# EAGLE board RADAR_Main_Board (EAGLE 7.4.0), part 1 of 7
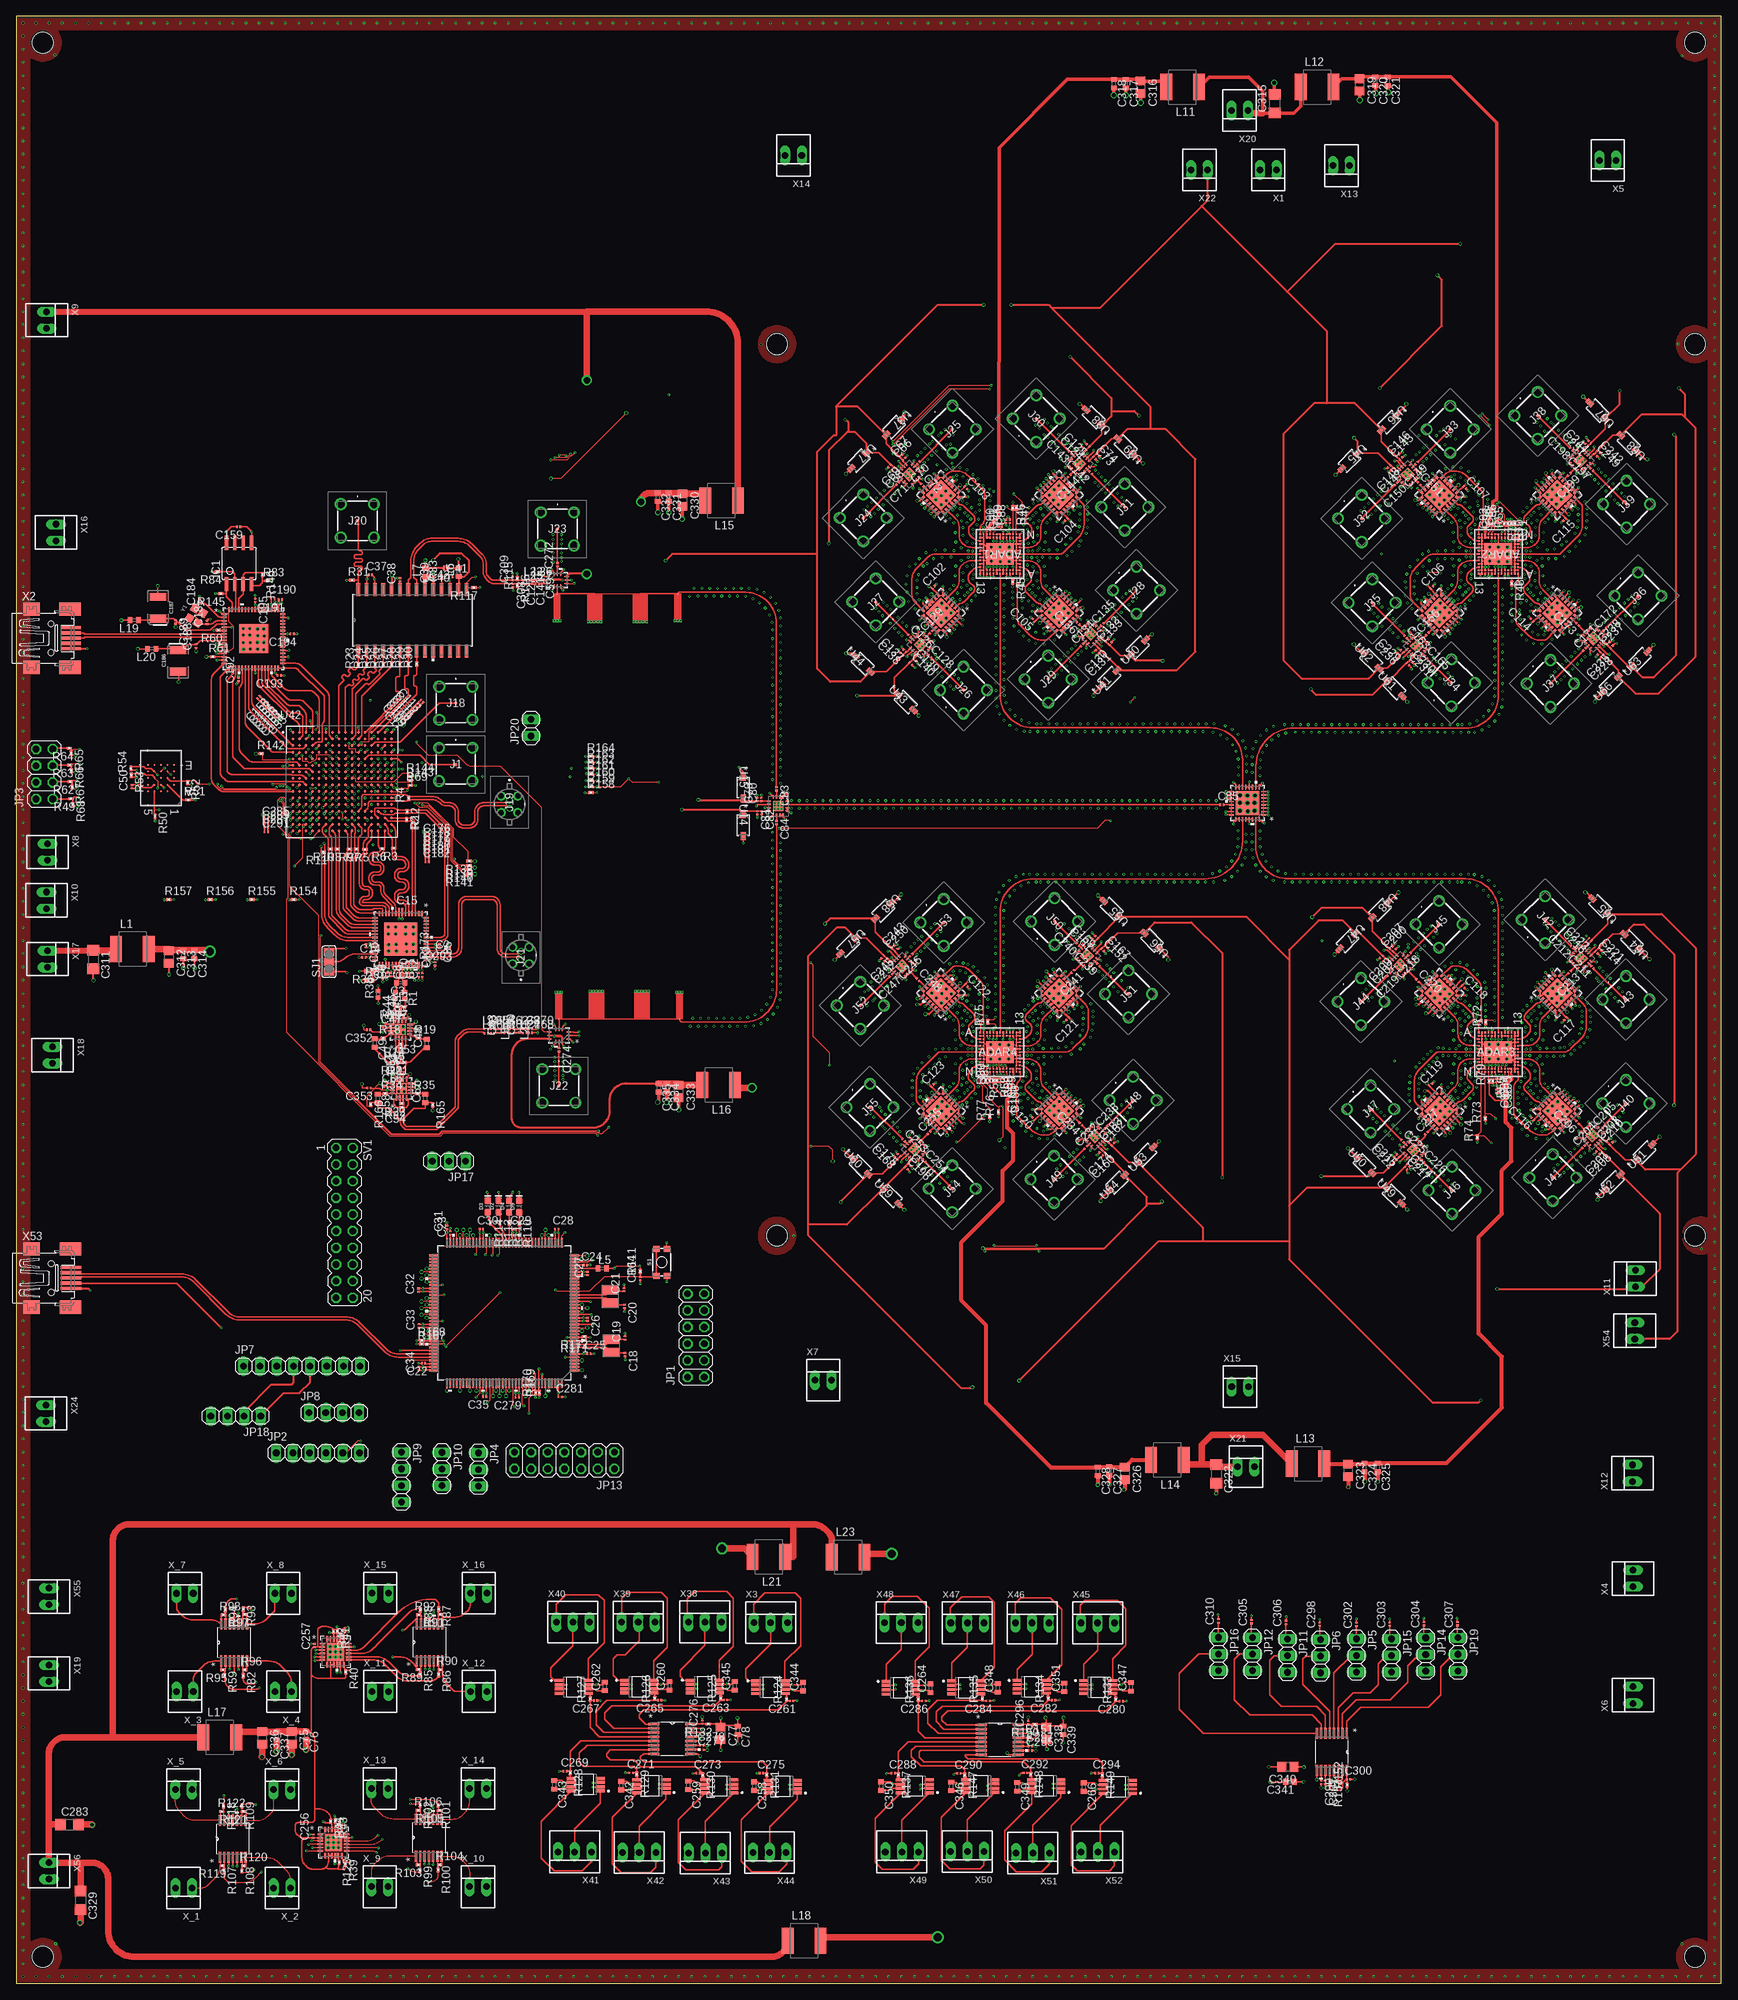
[diagram p20: board, top side]
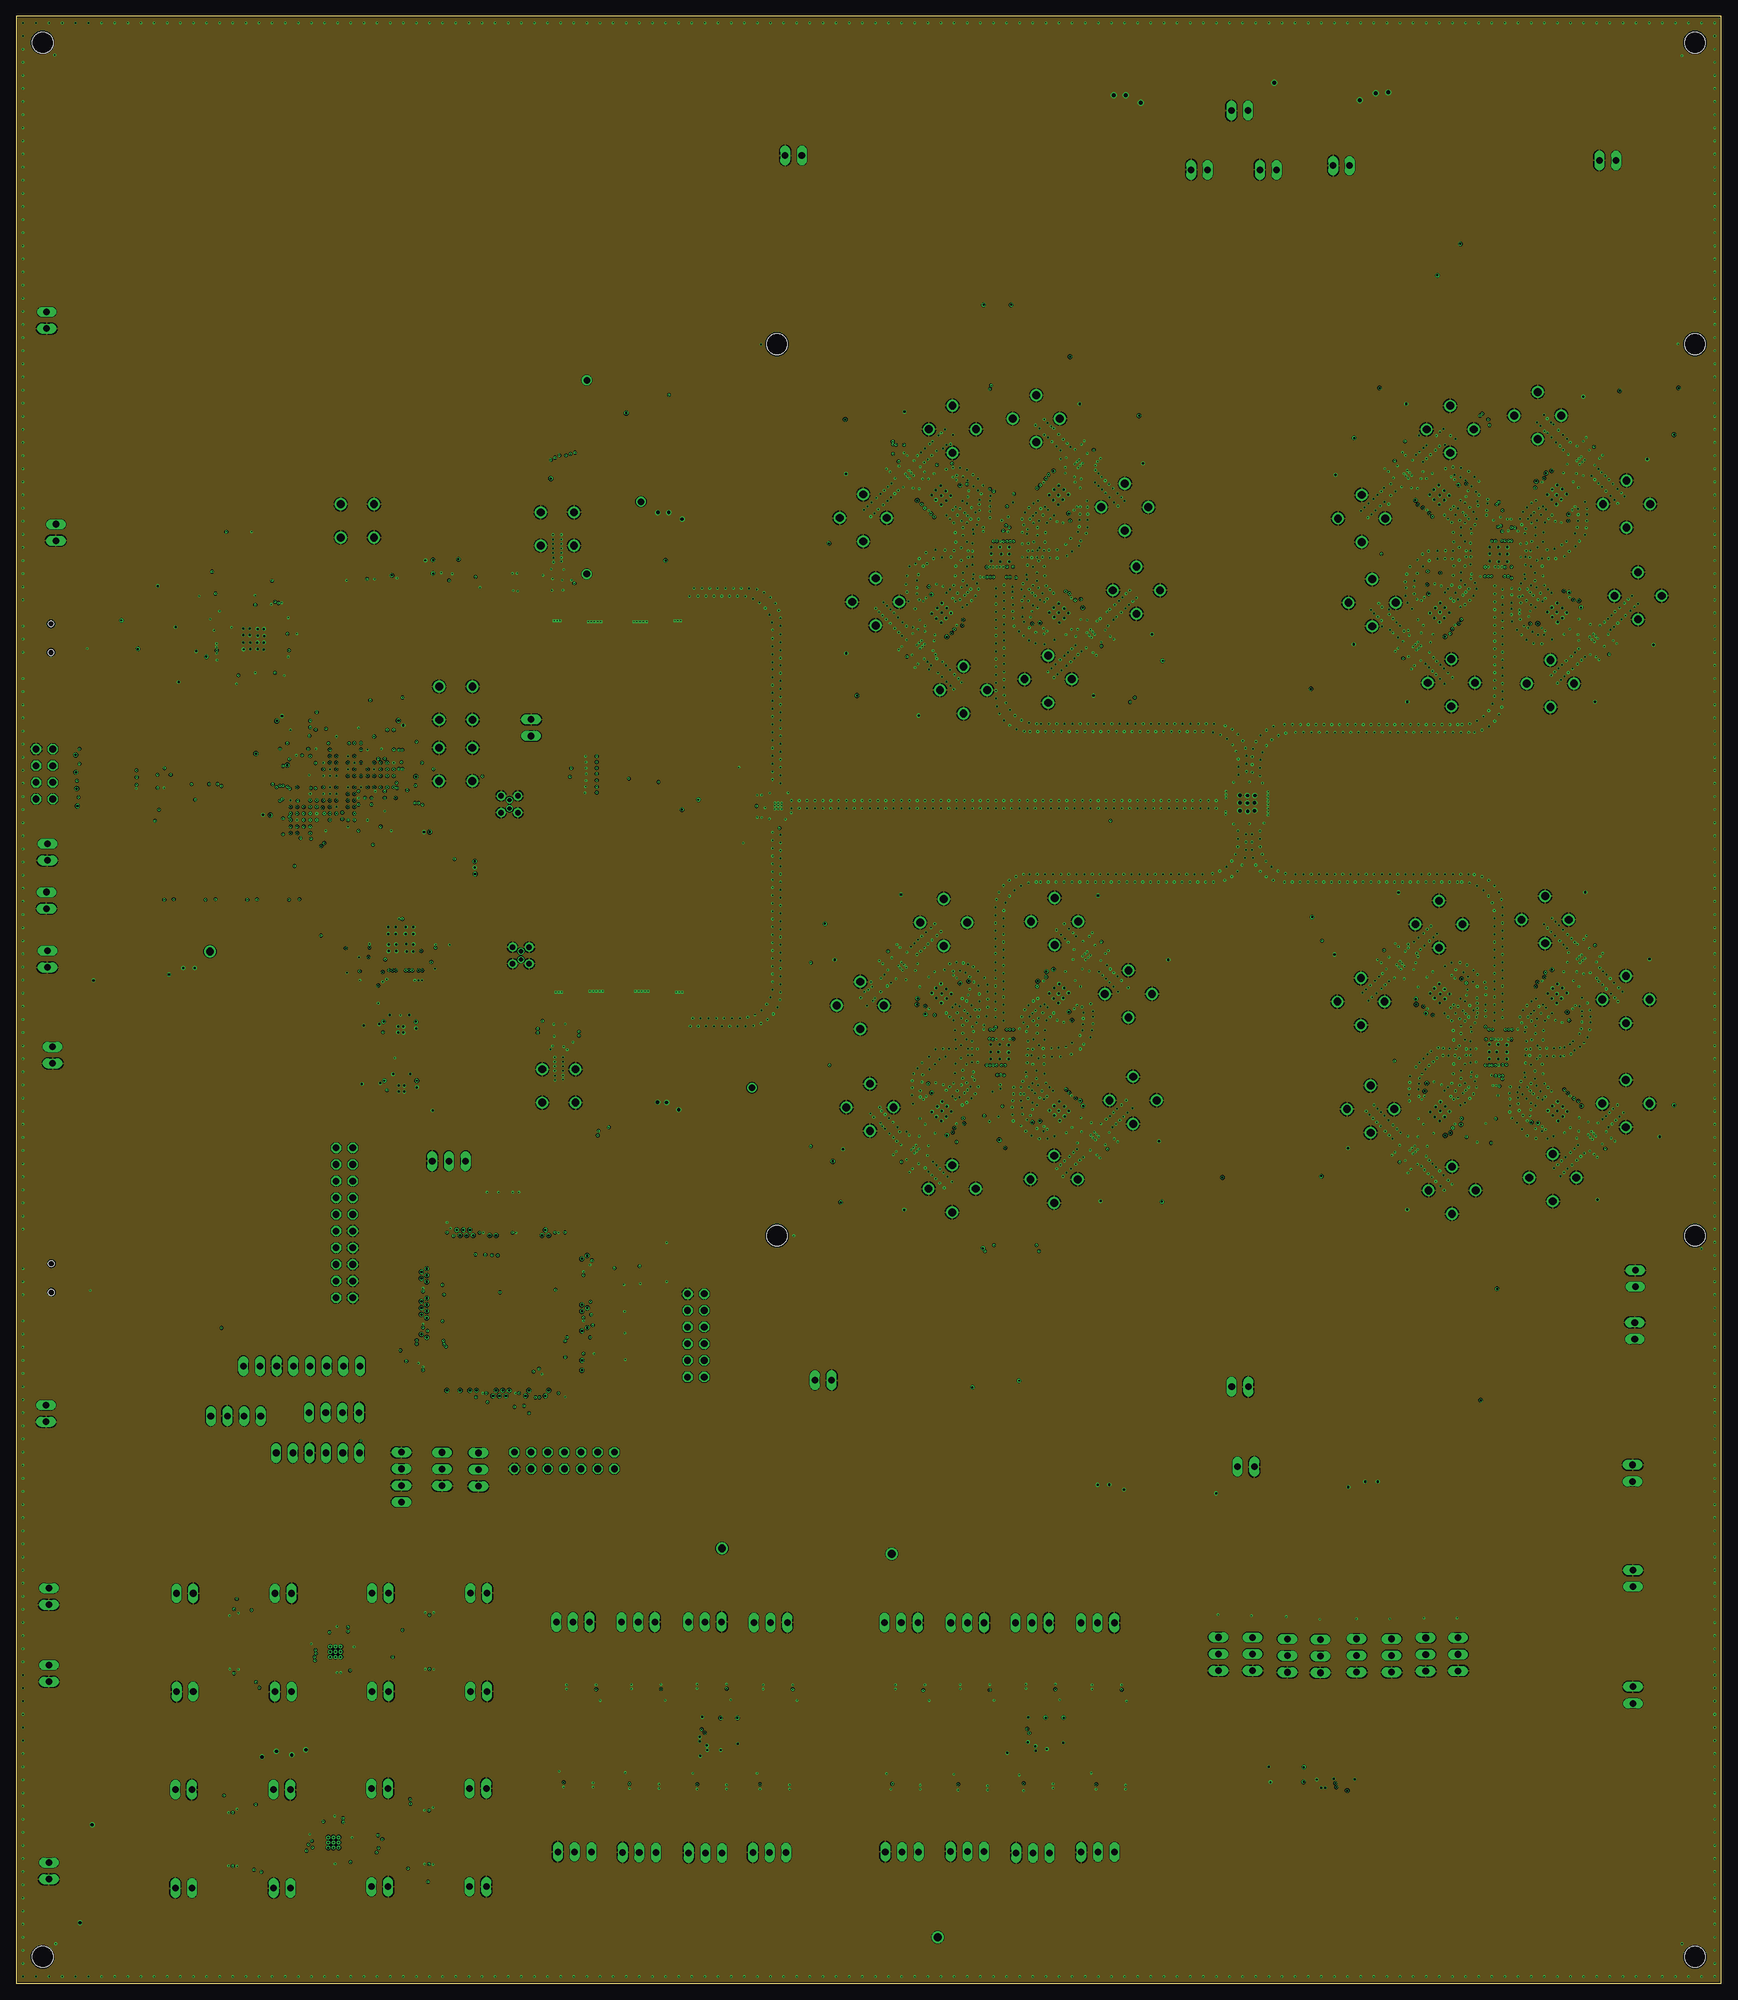
[diagram p21: board, inner layer Route2]
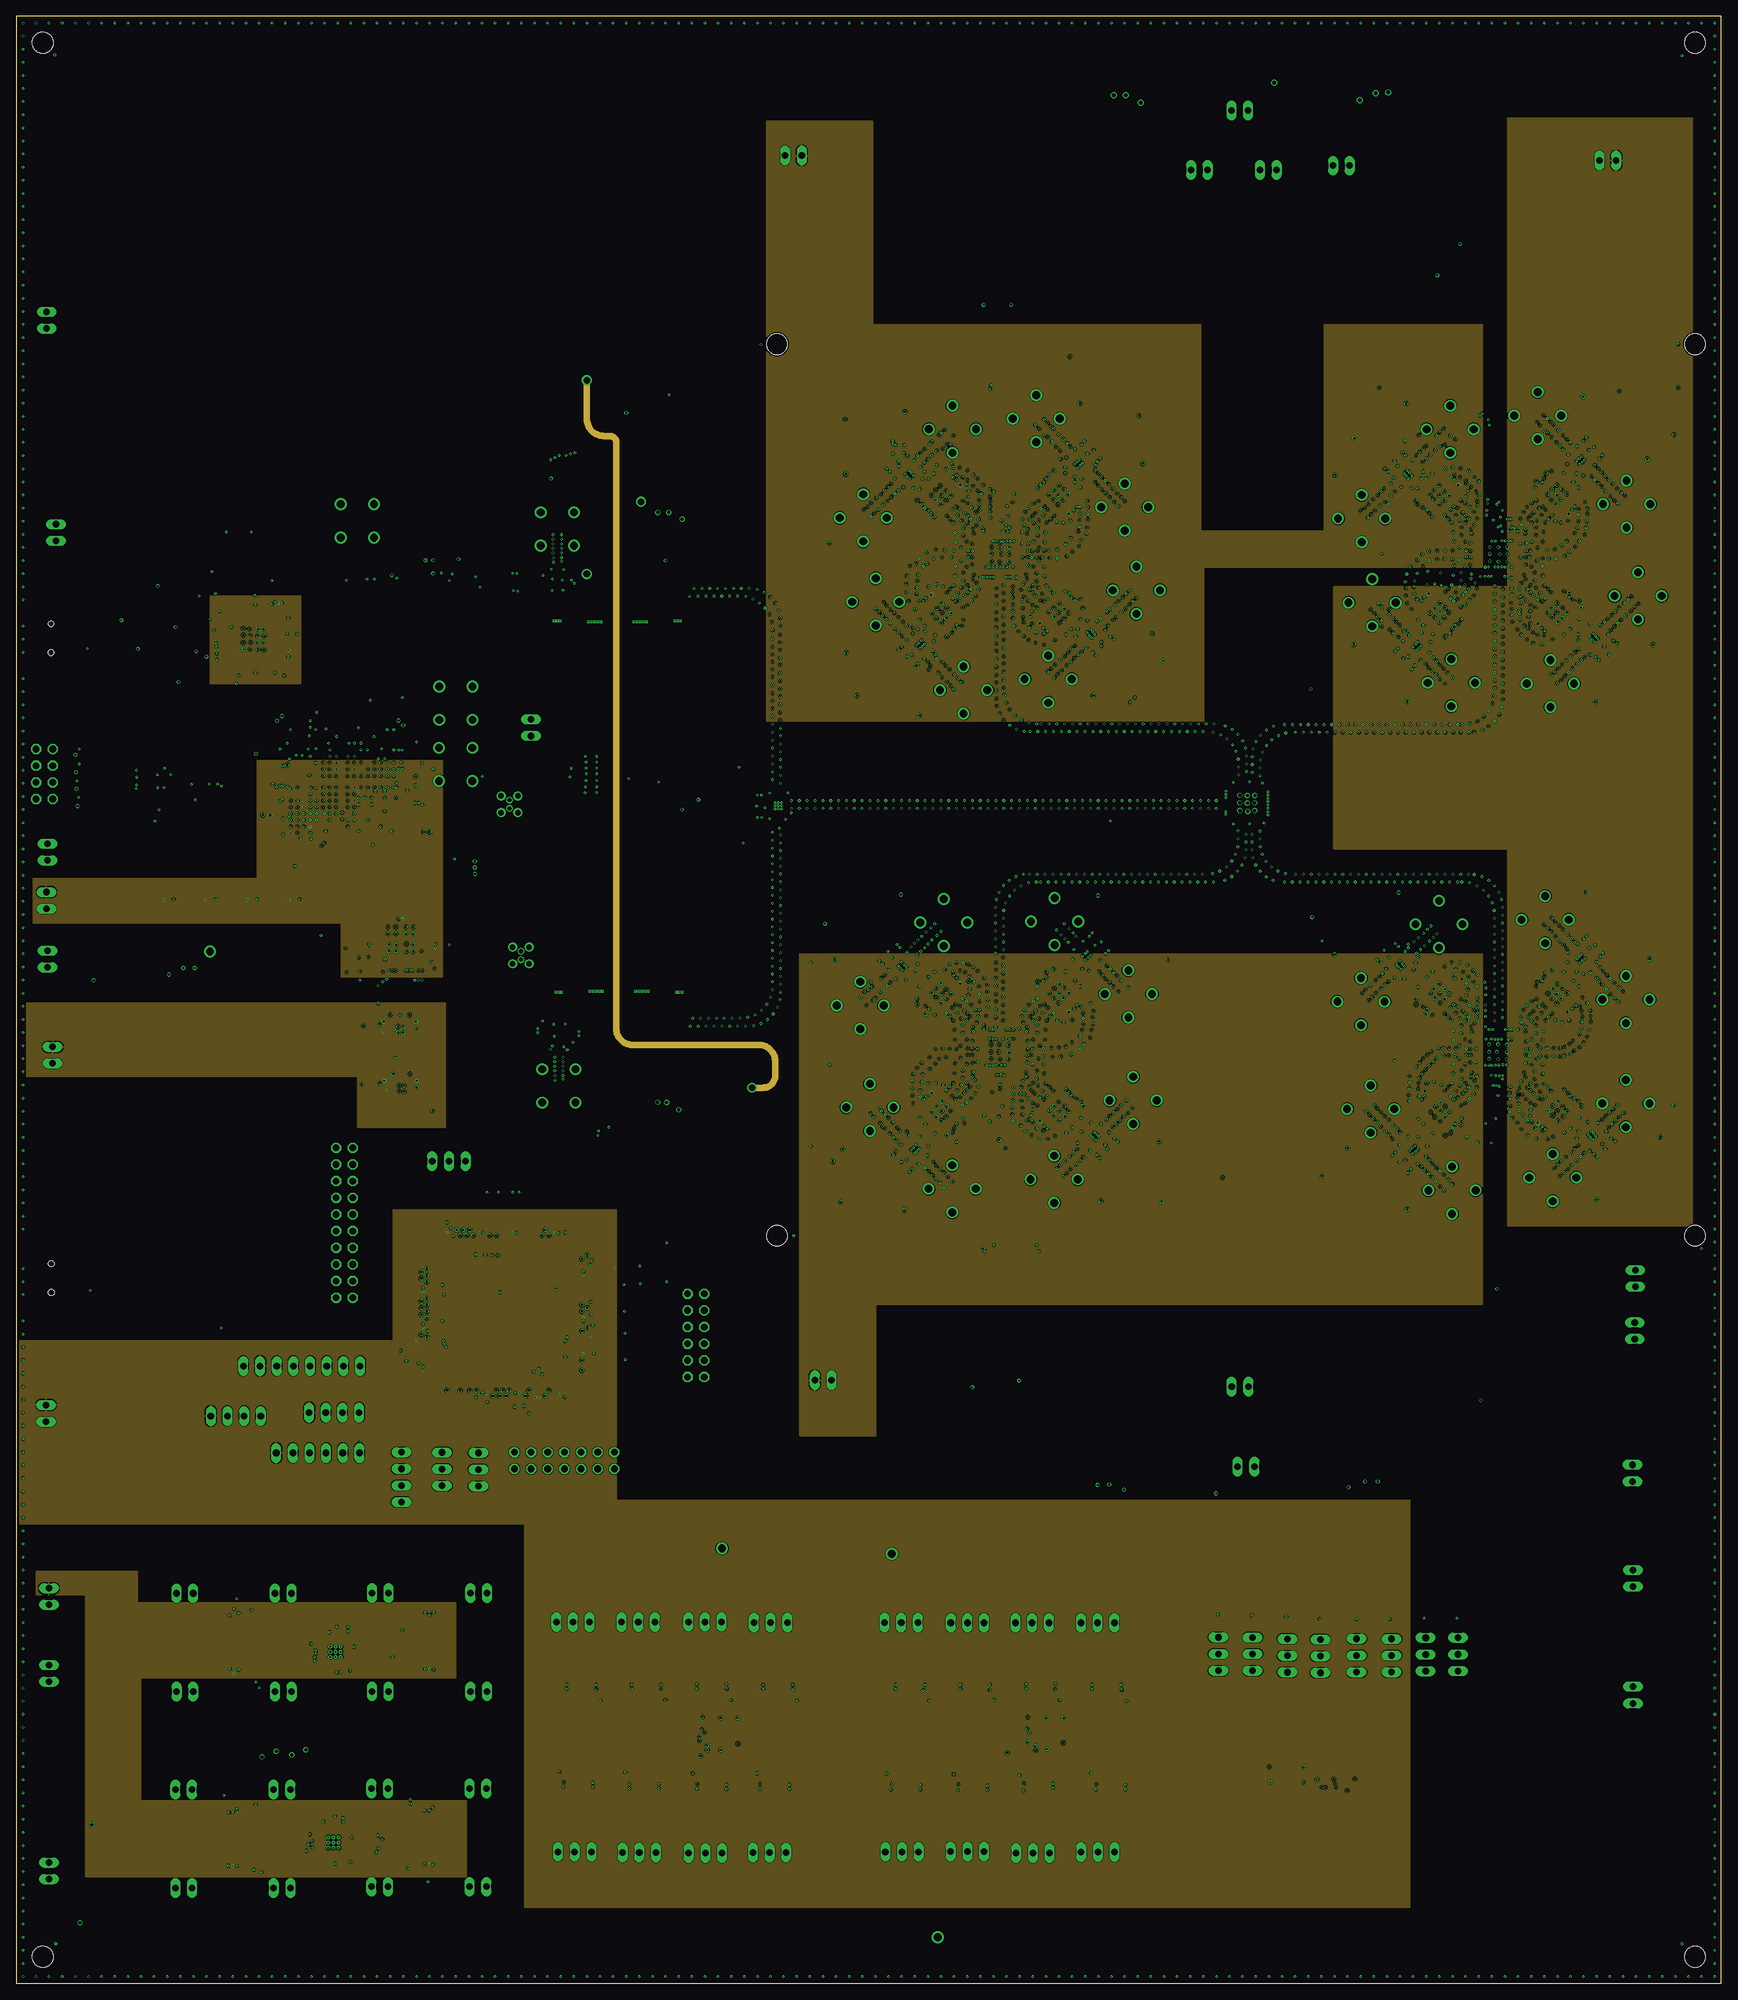
[diagram p22: board, inner layer Route3]
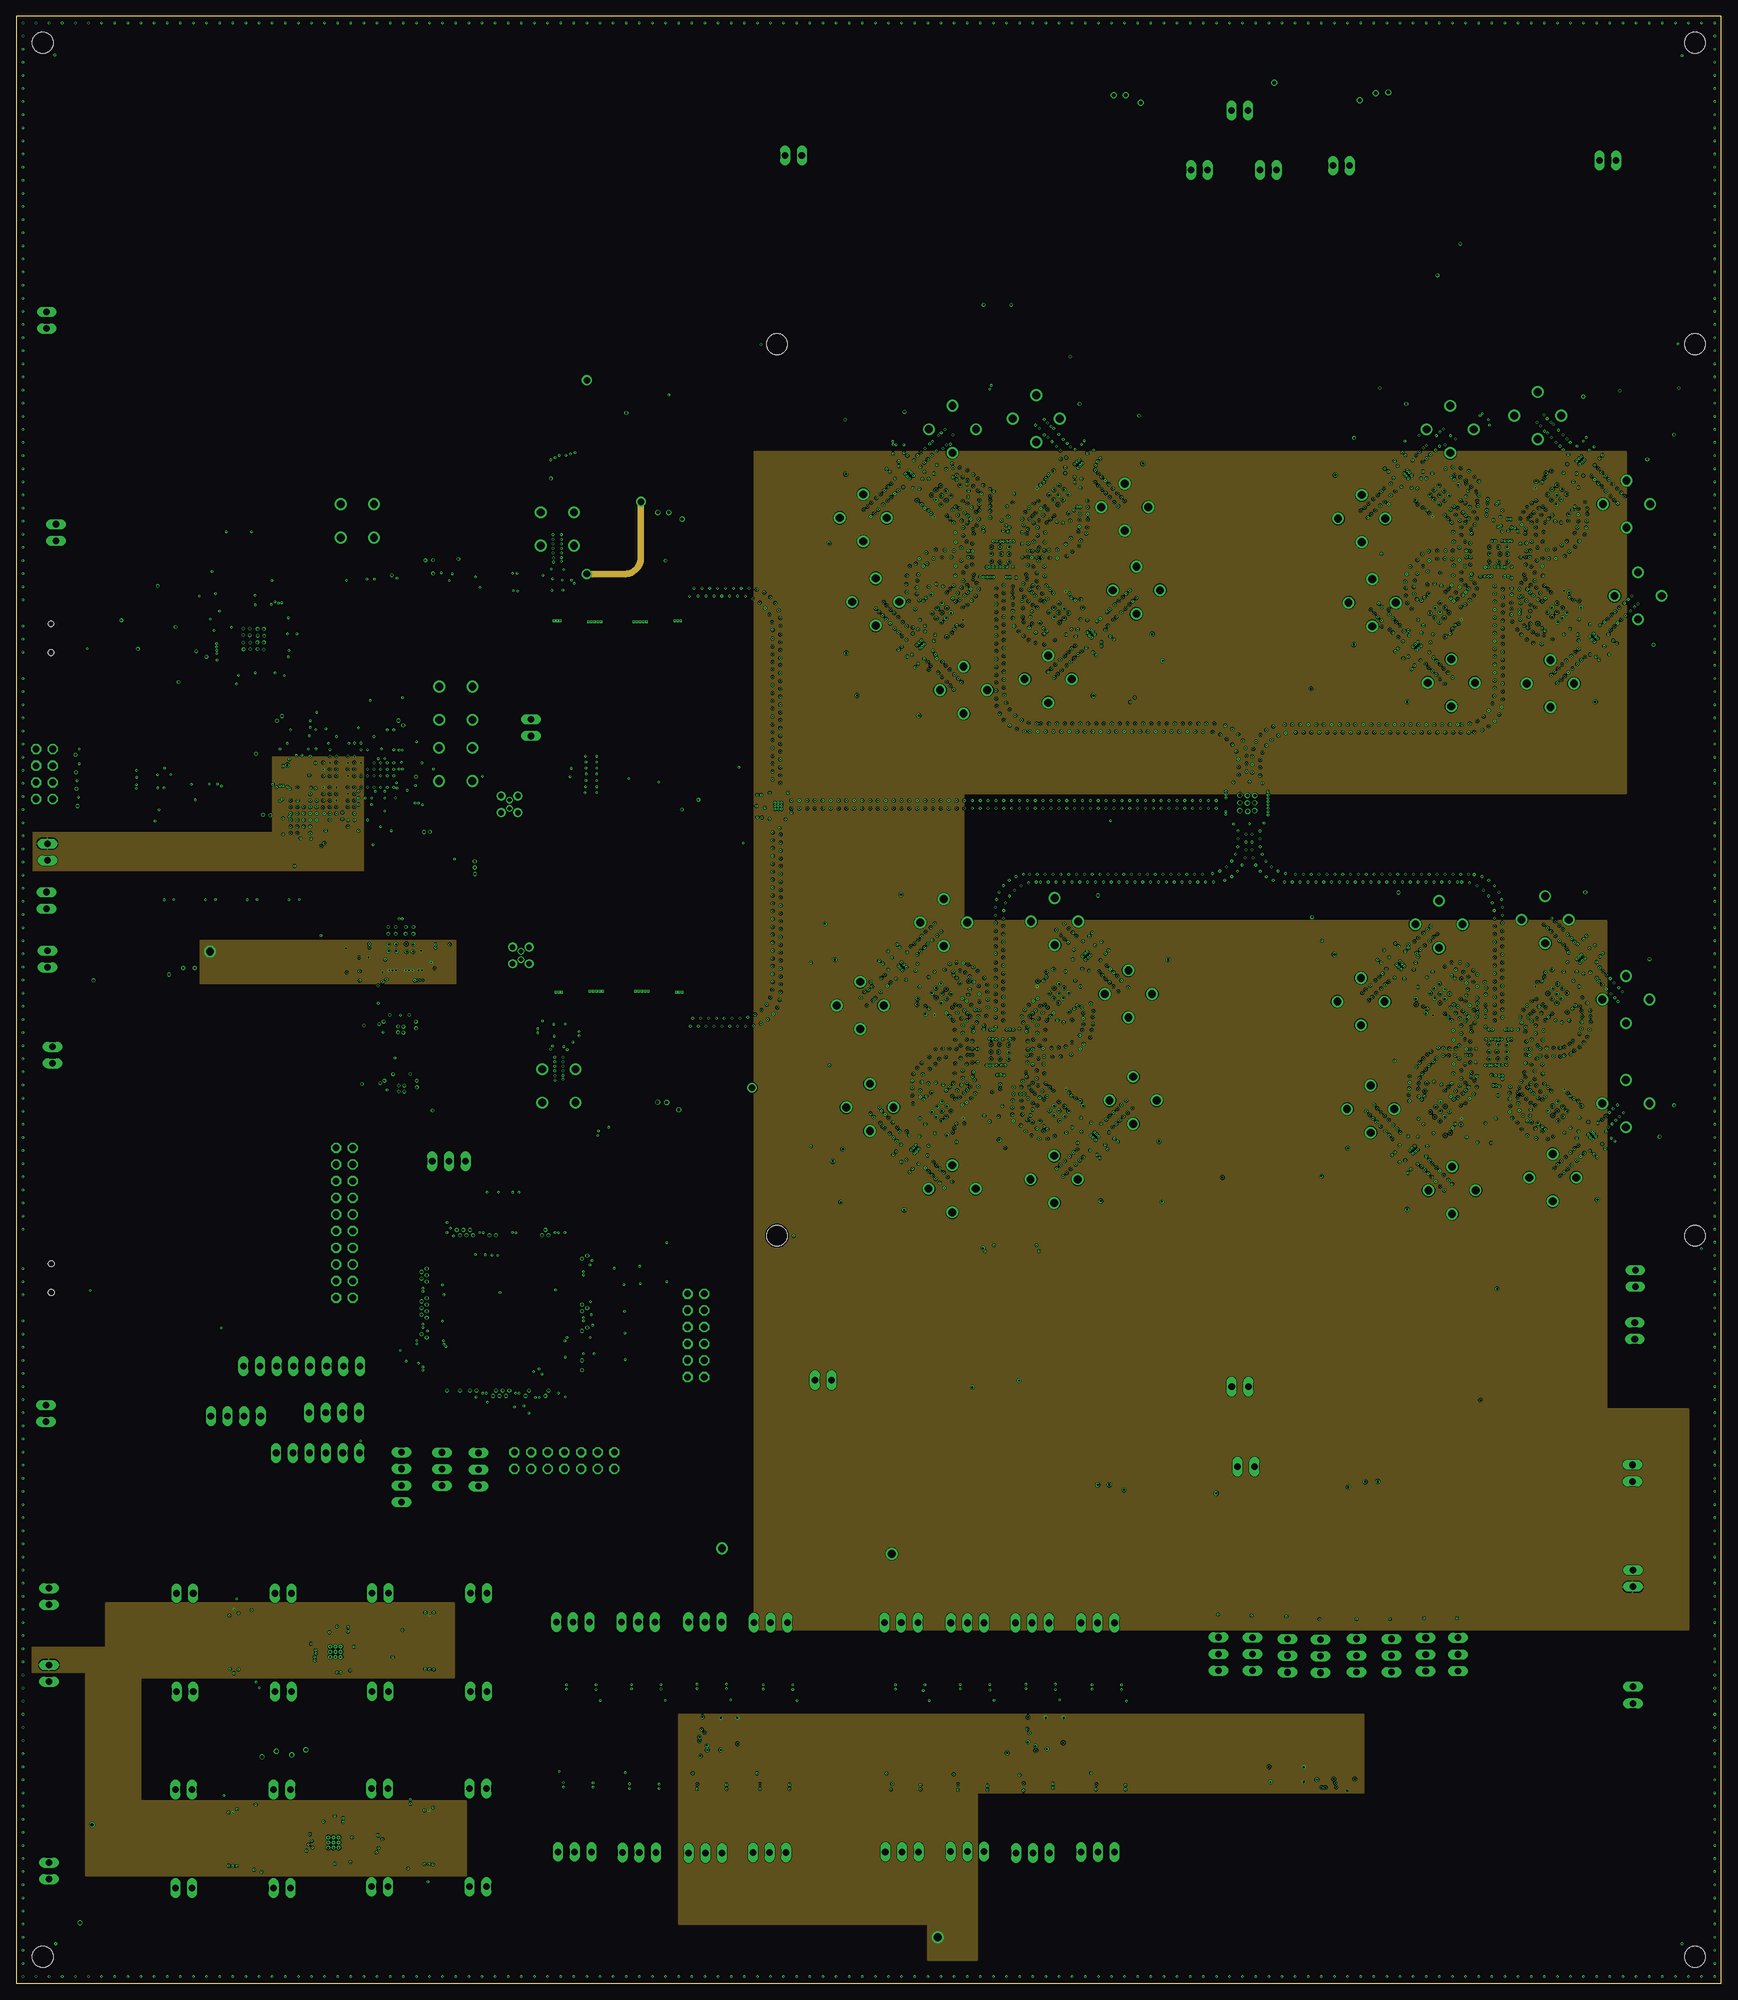
[diagram p23: board, inner layer Route4]
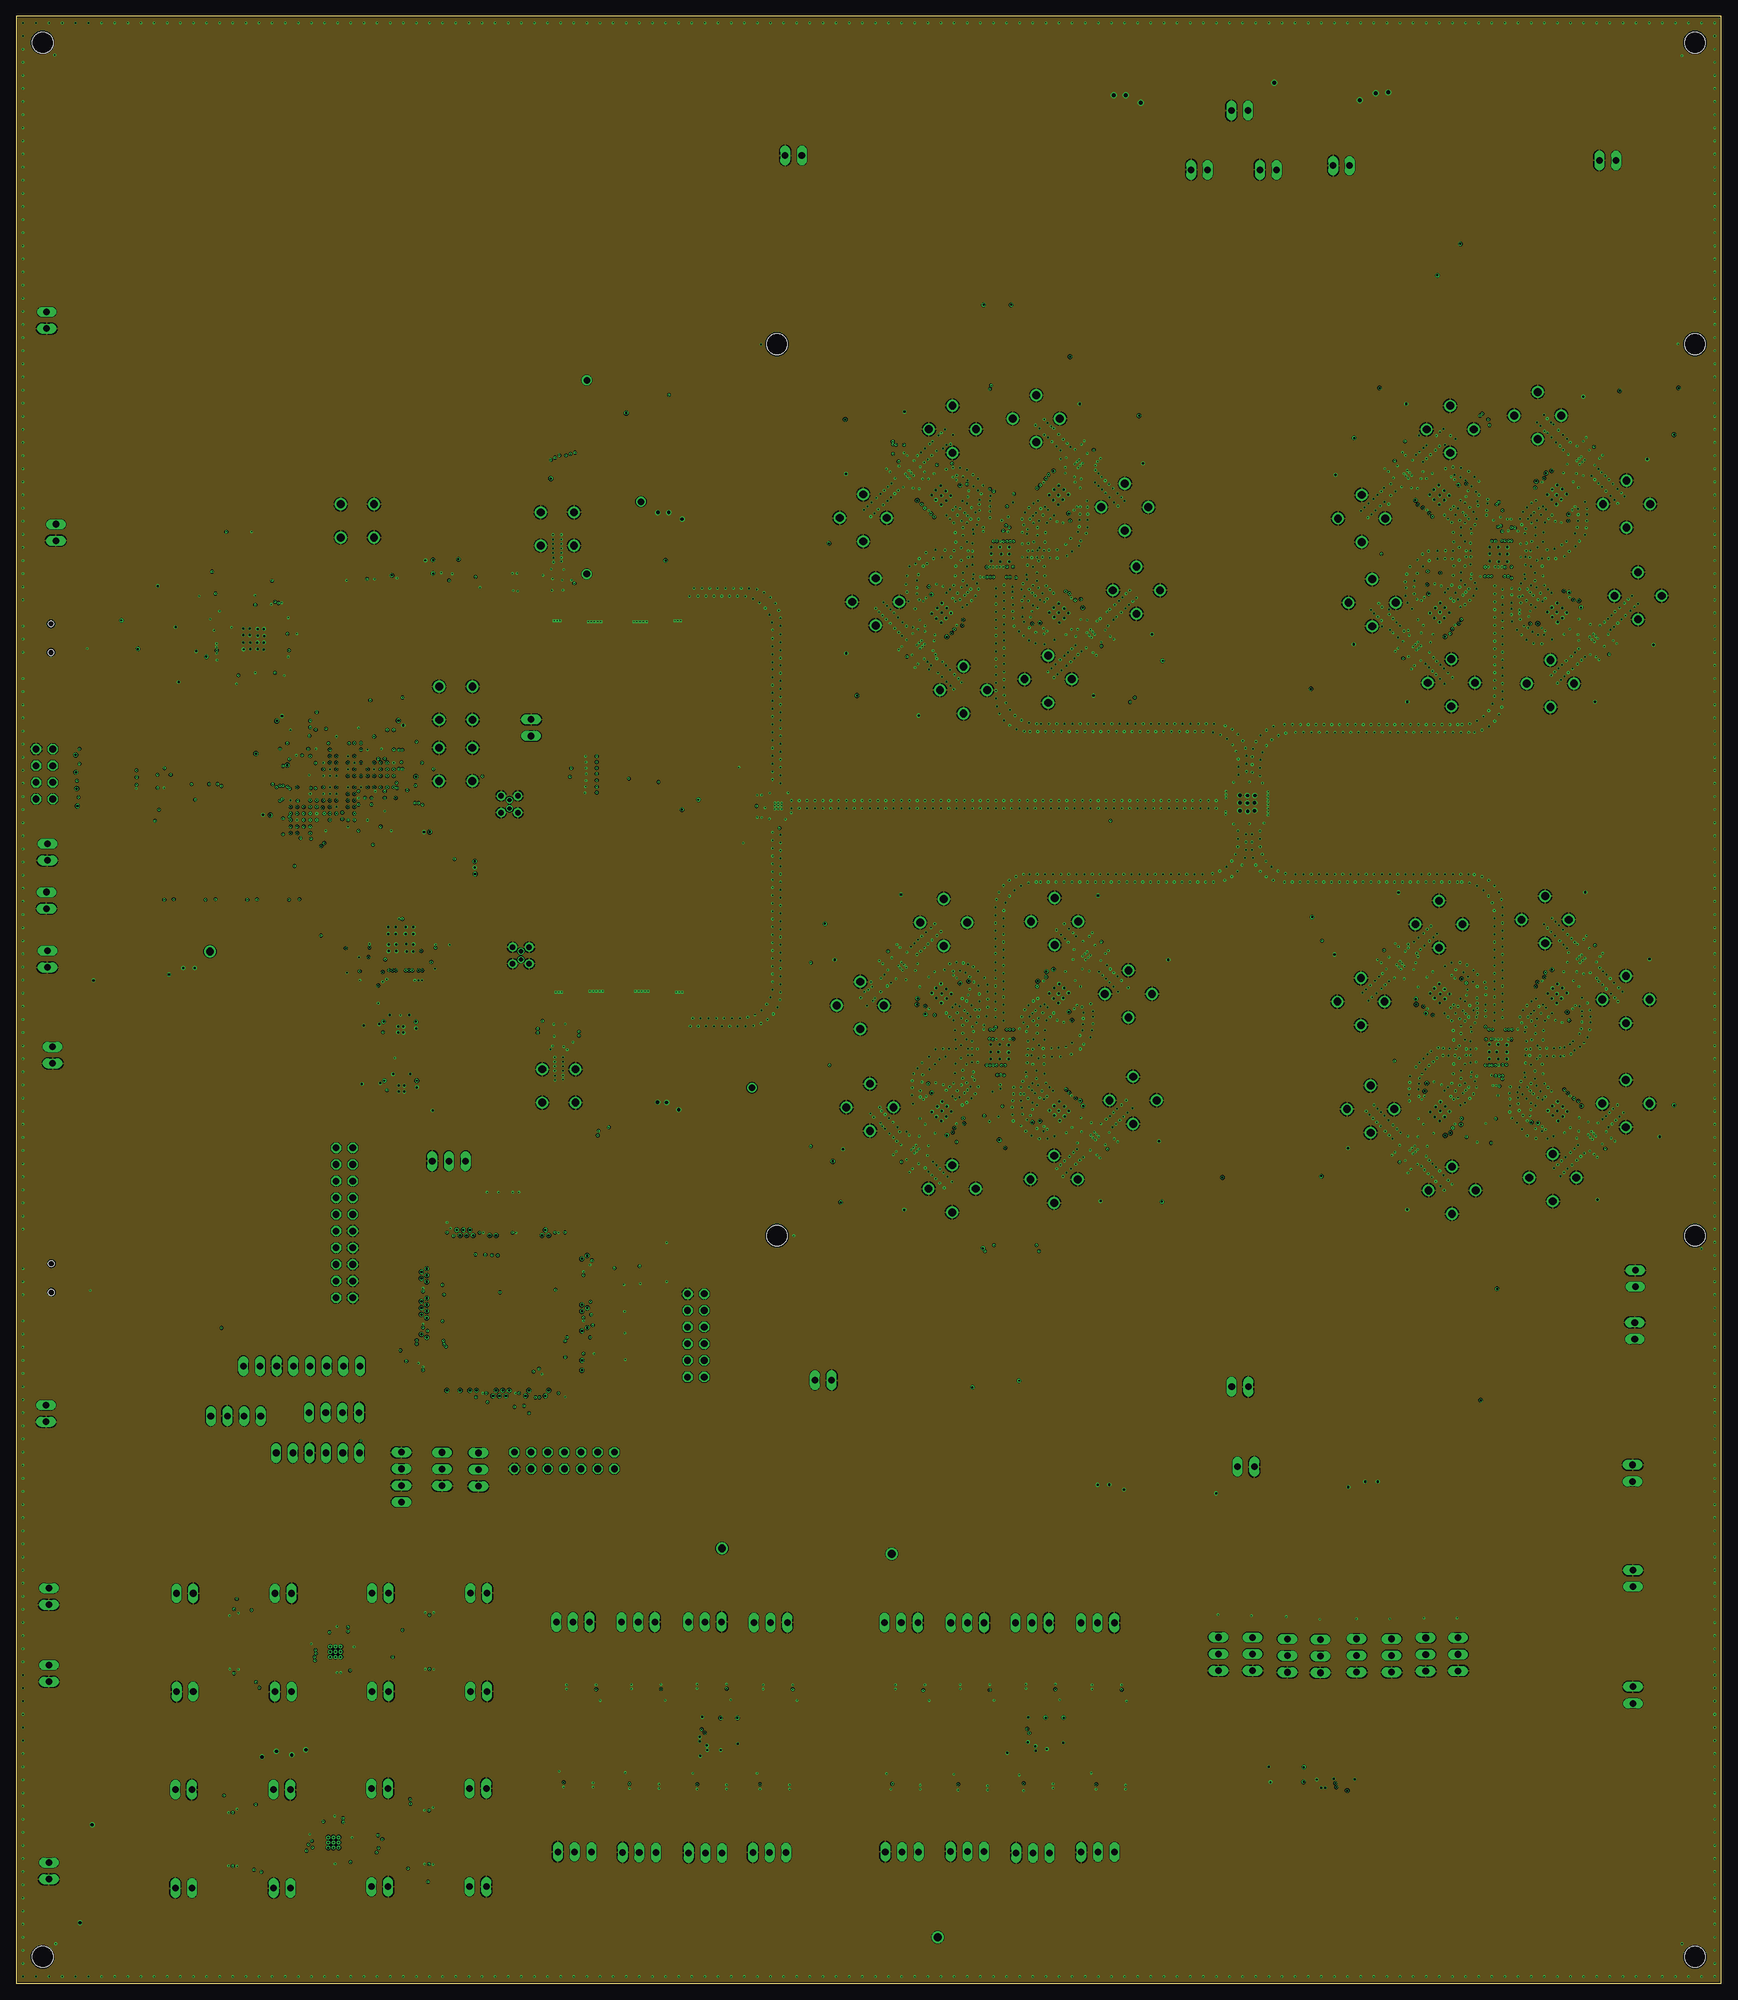
[diagram p24: board, inner layer Route5]
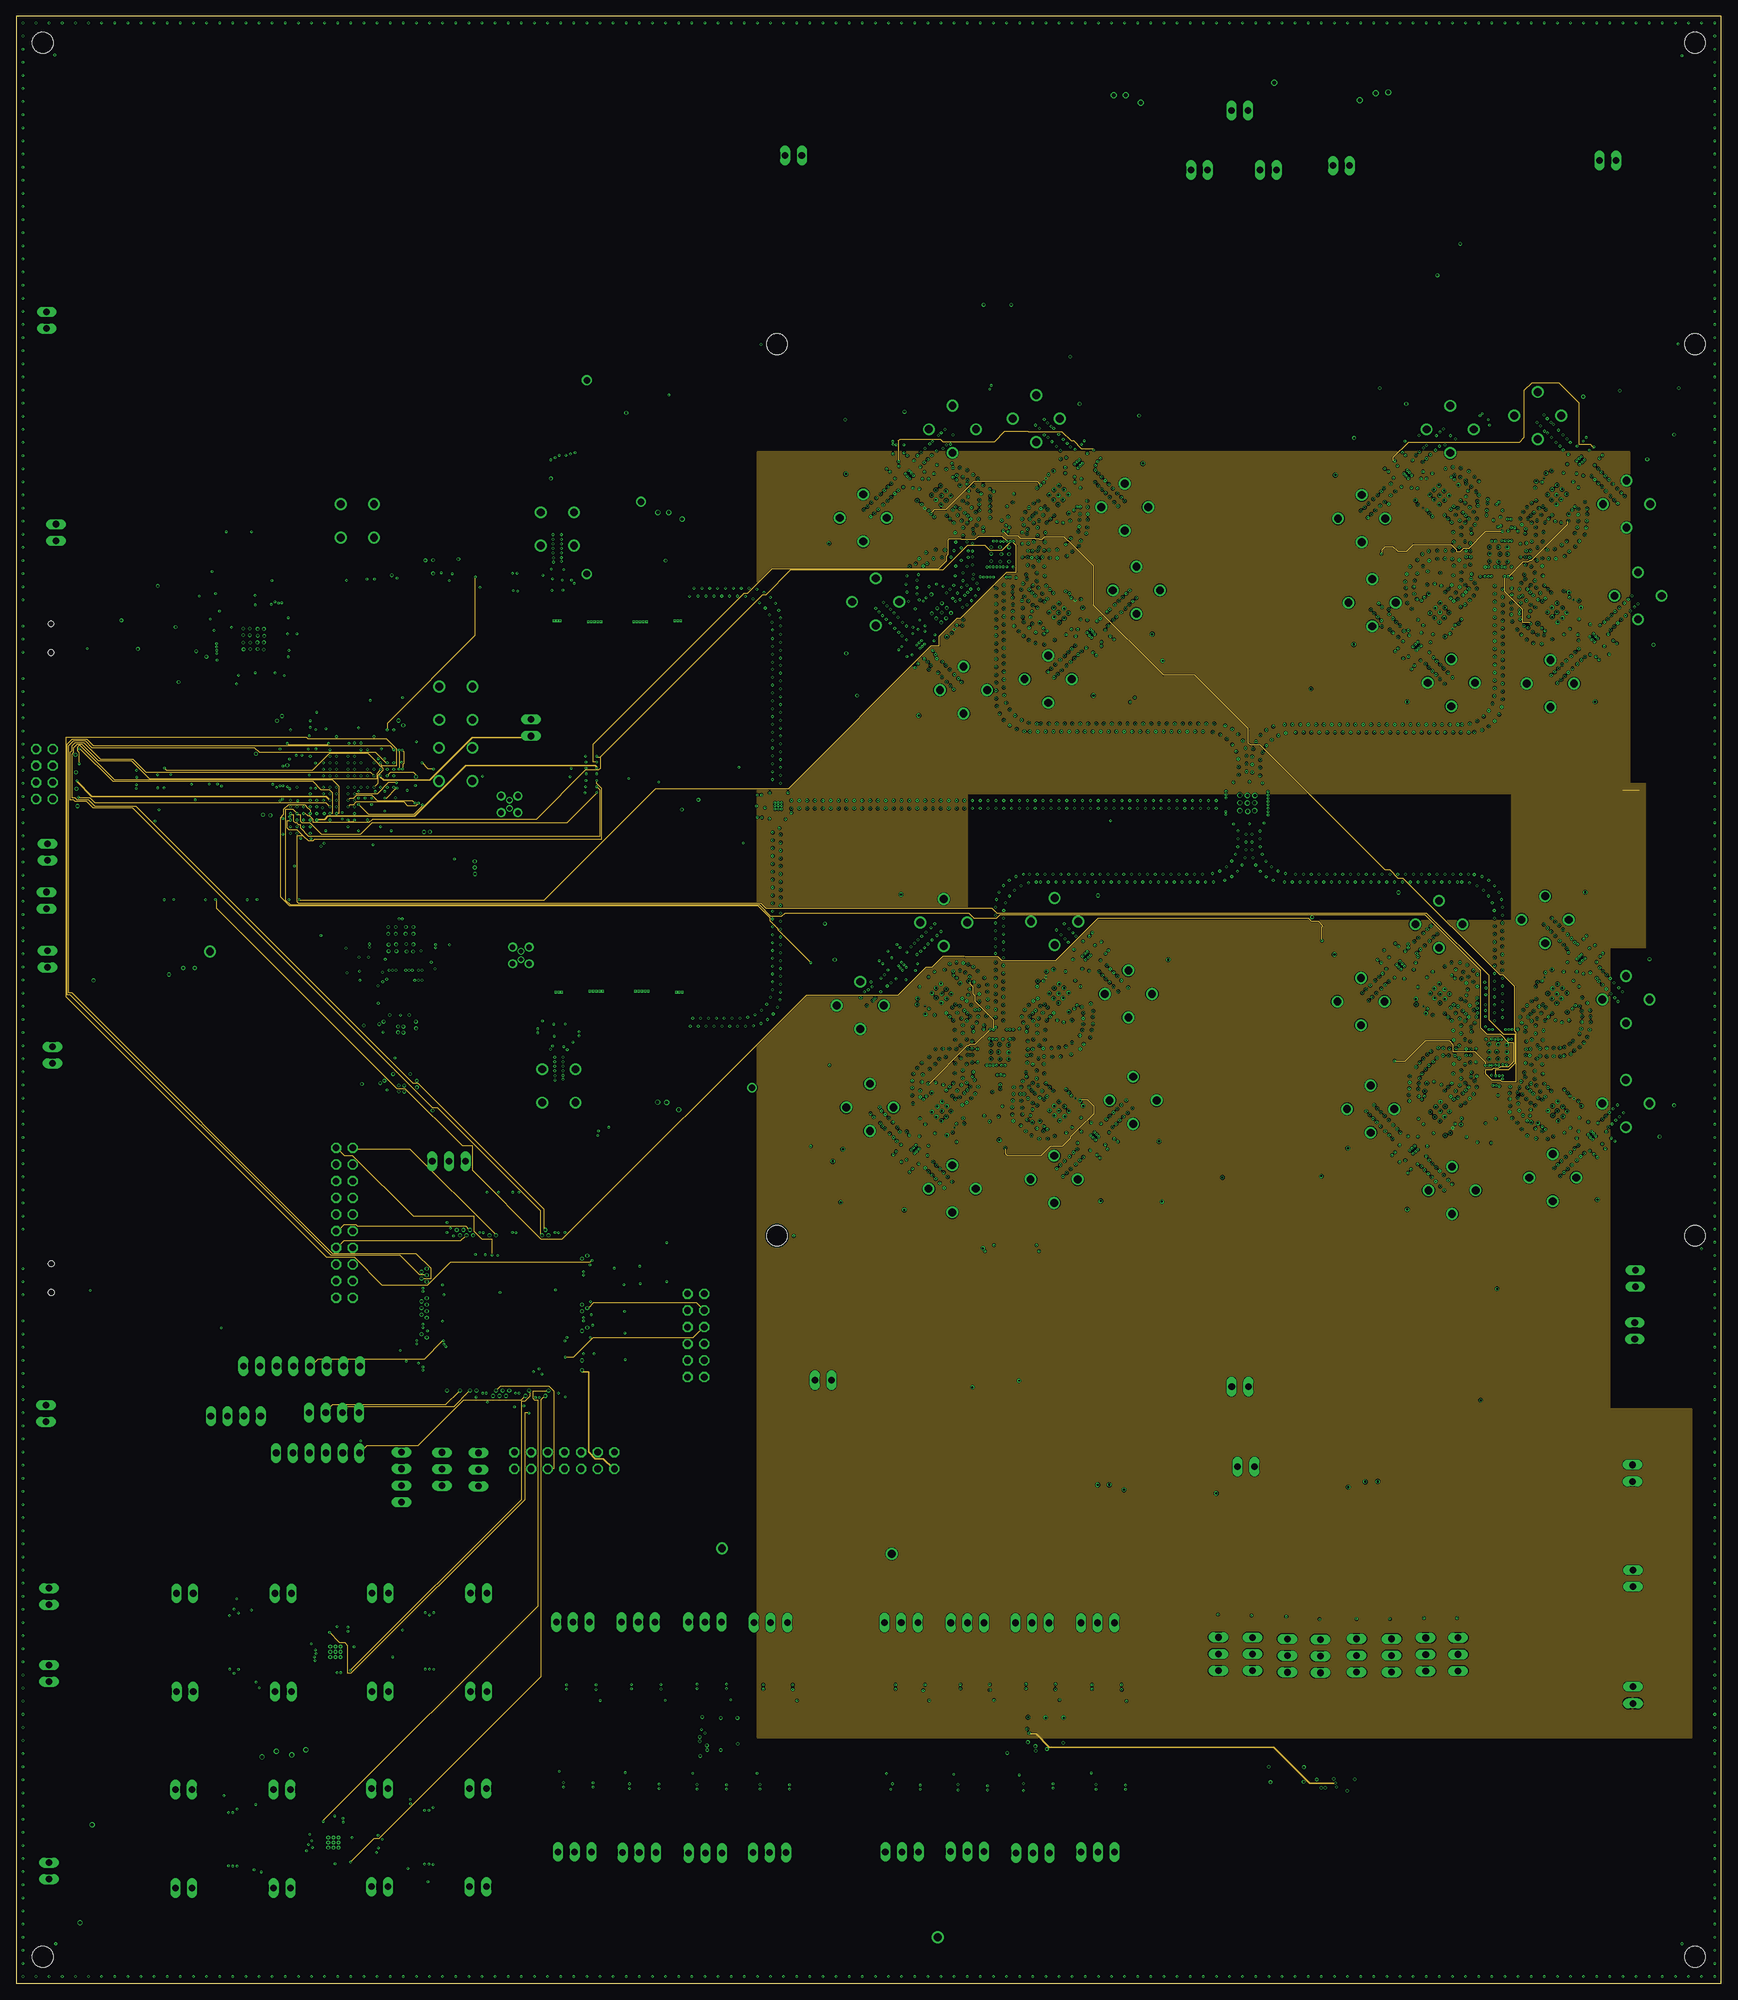
[diagram p25: board, inner layer Route12]
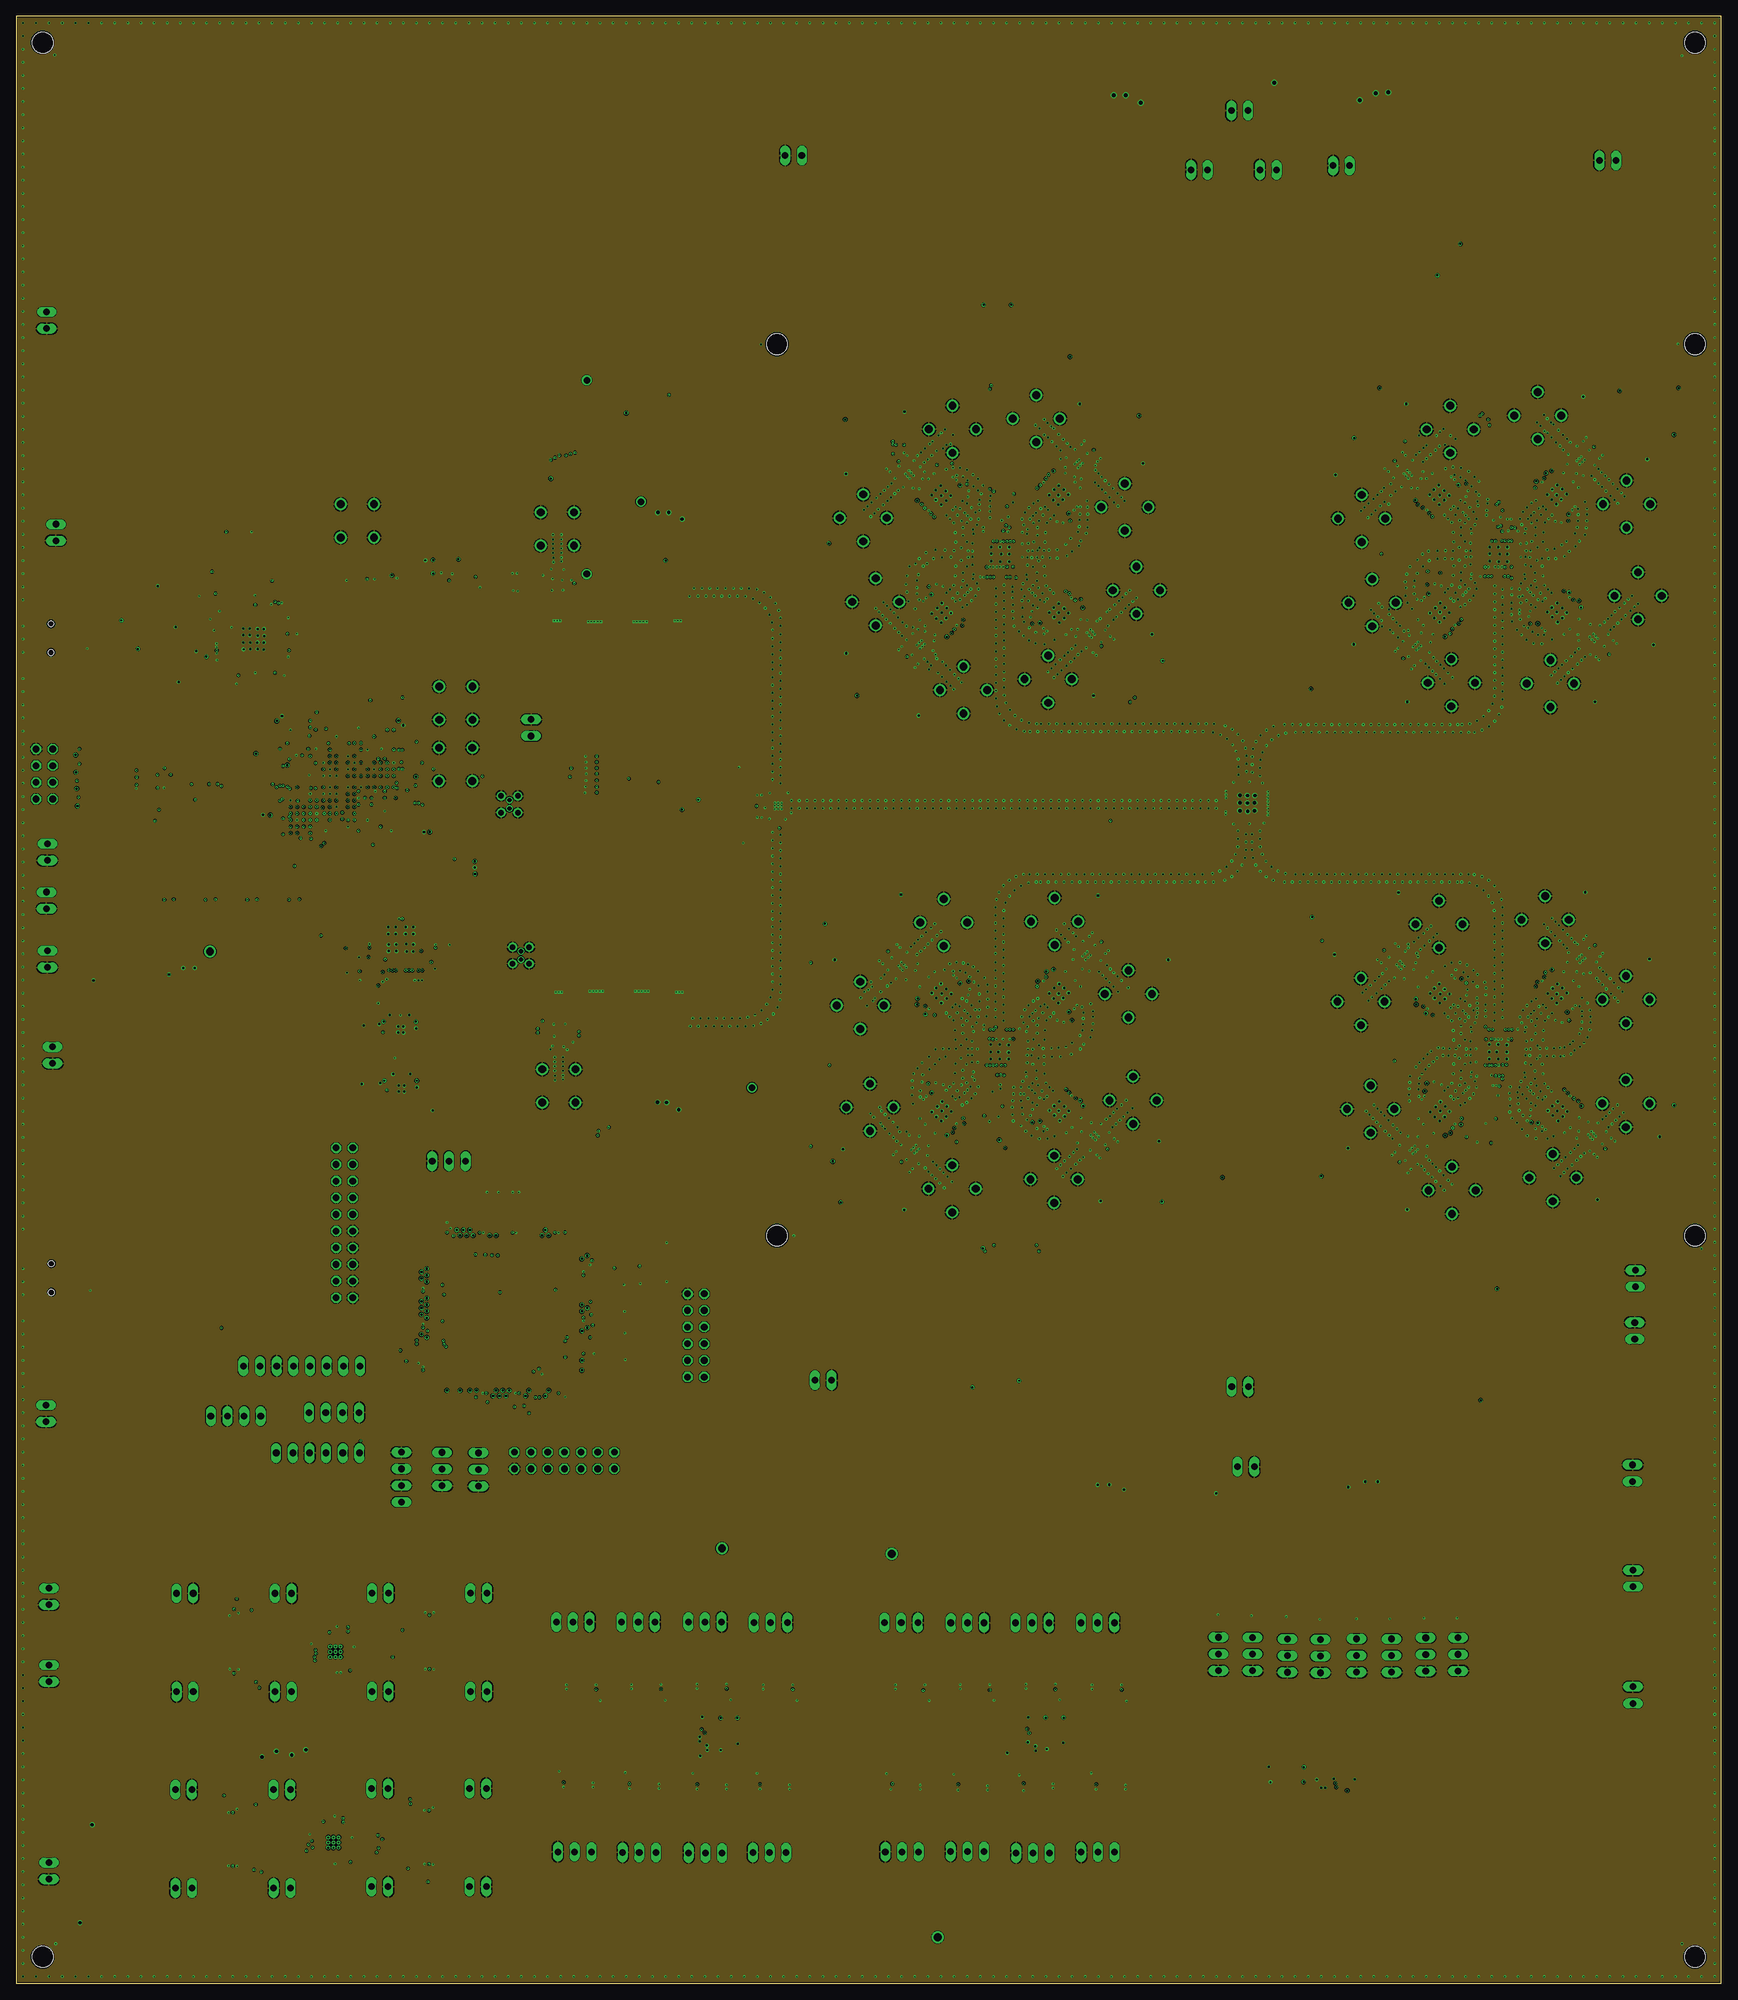
[diagram p26: board, inner layer Route13]
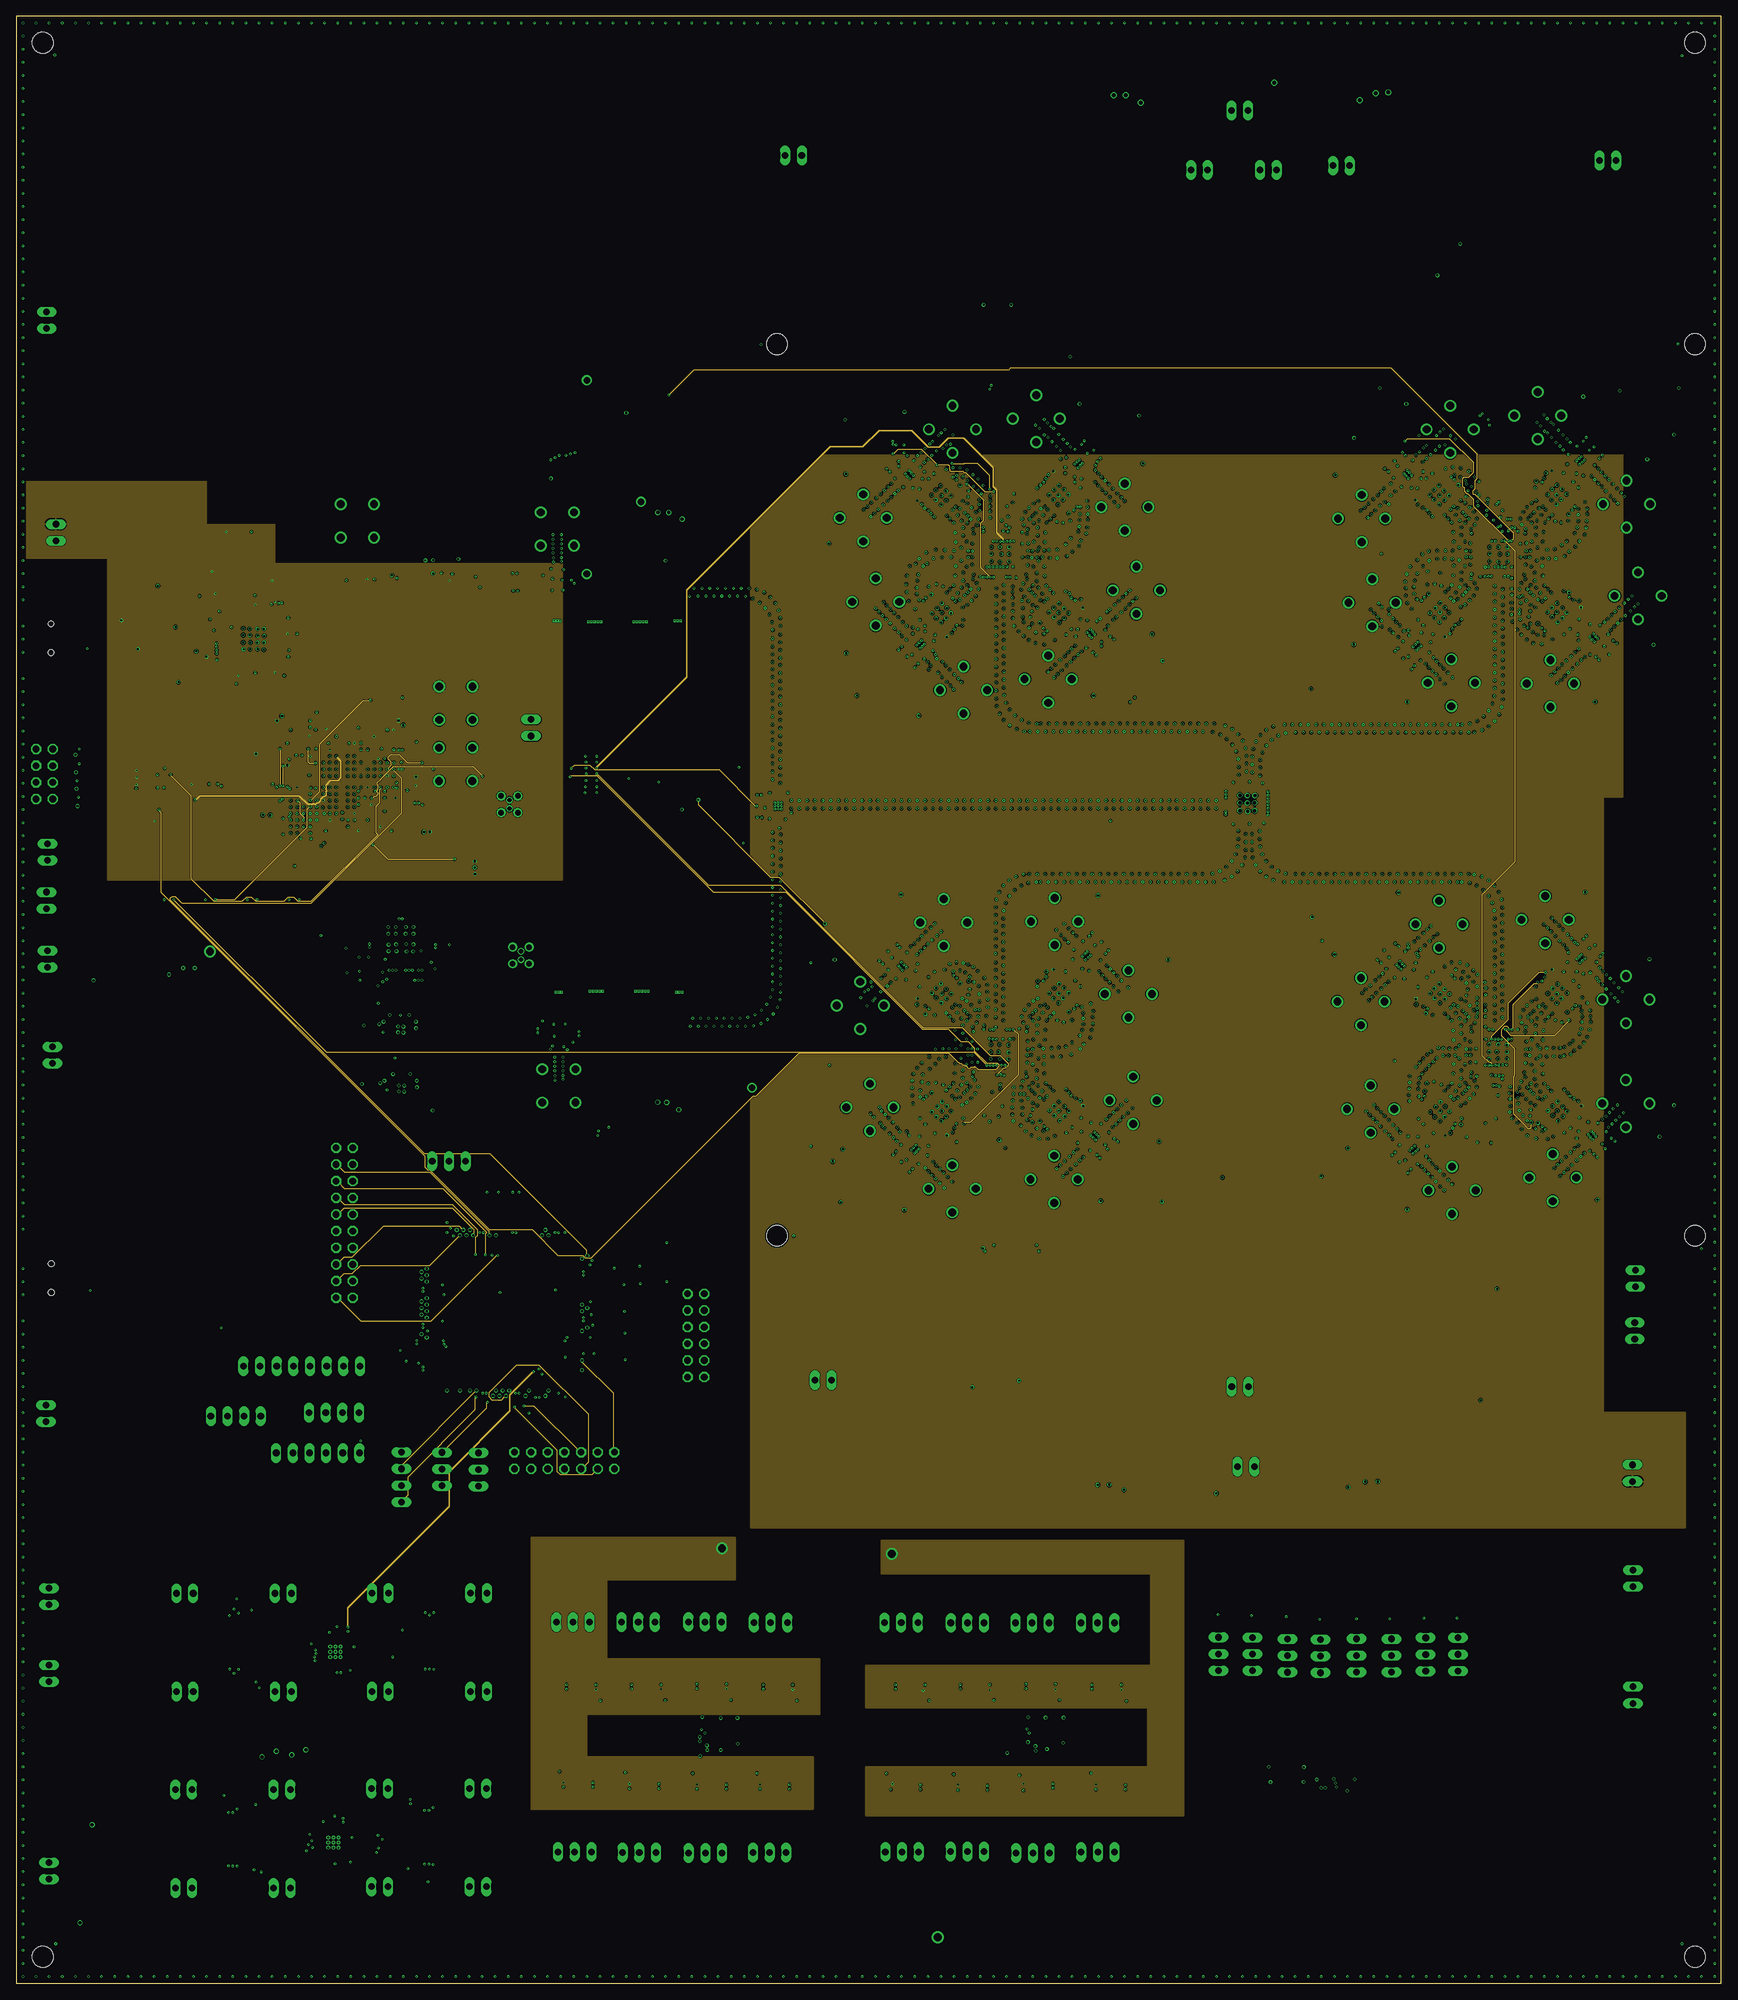
[diagram p27: board, inner layer Route14]
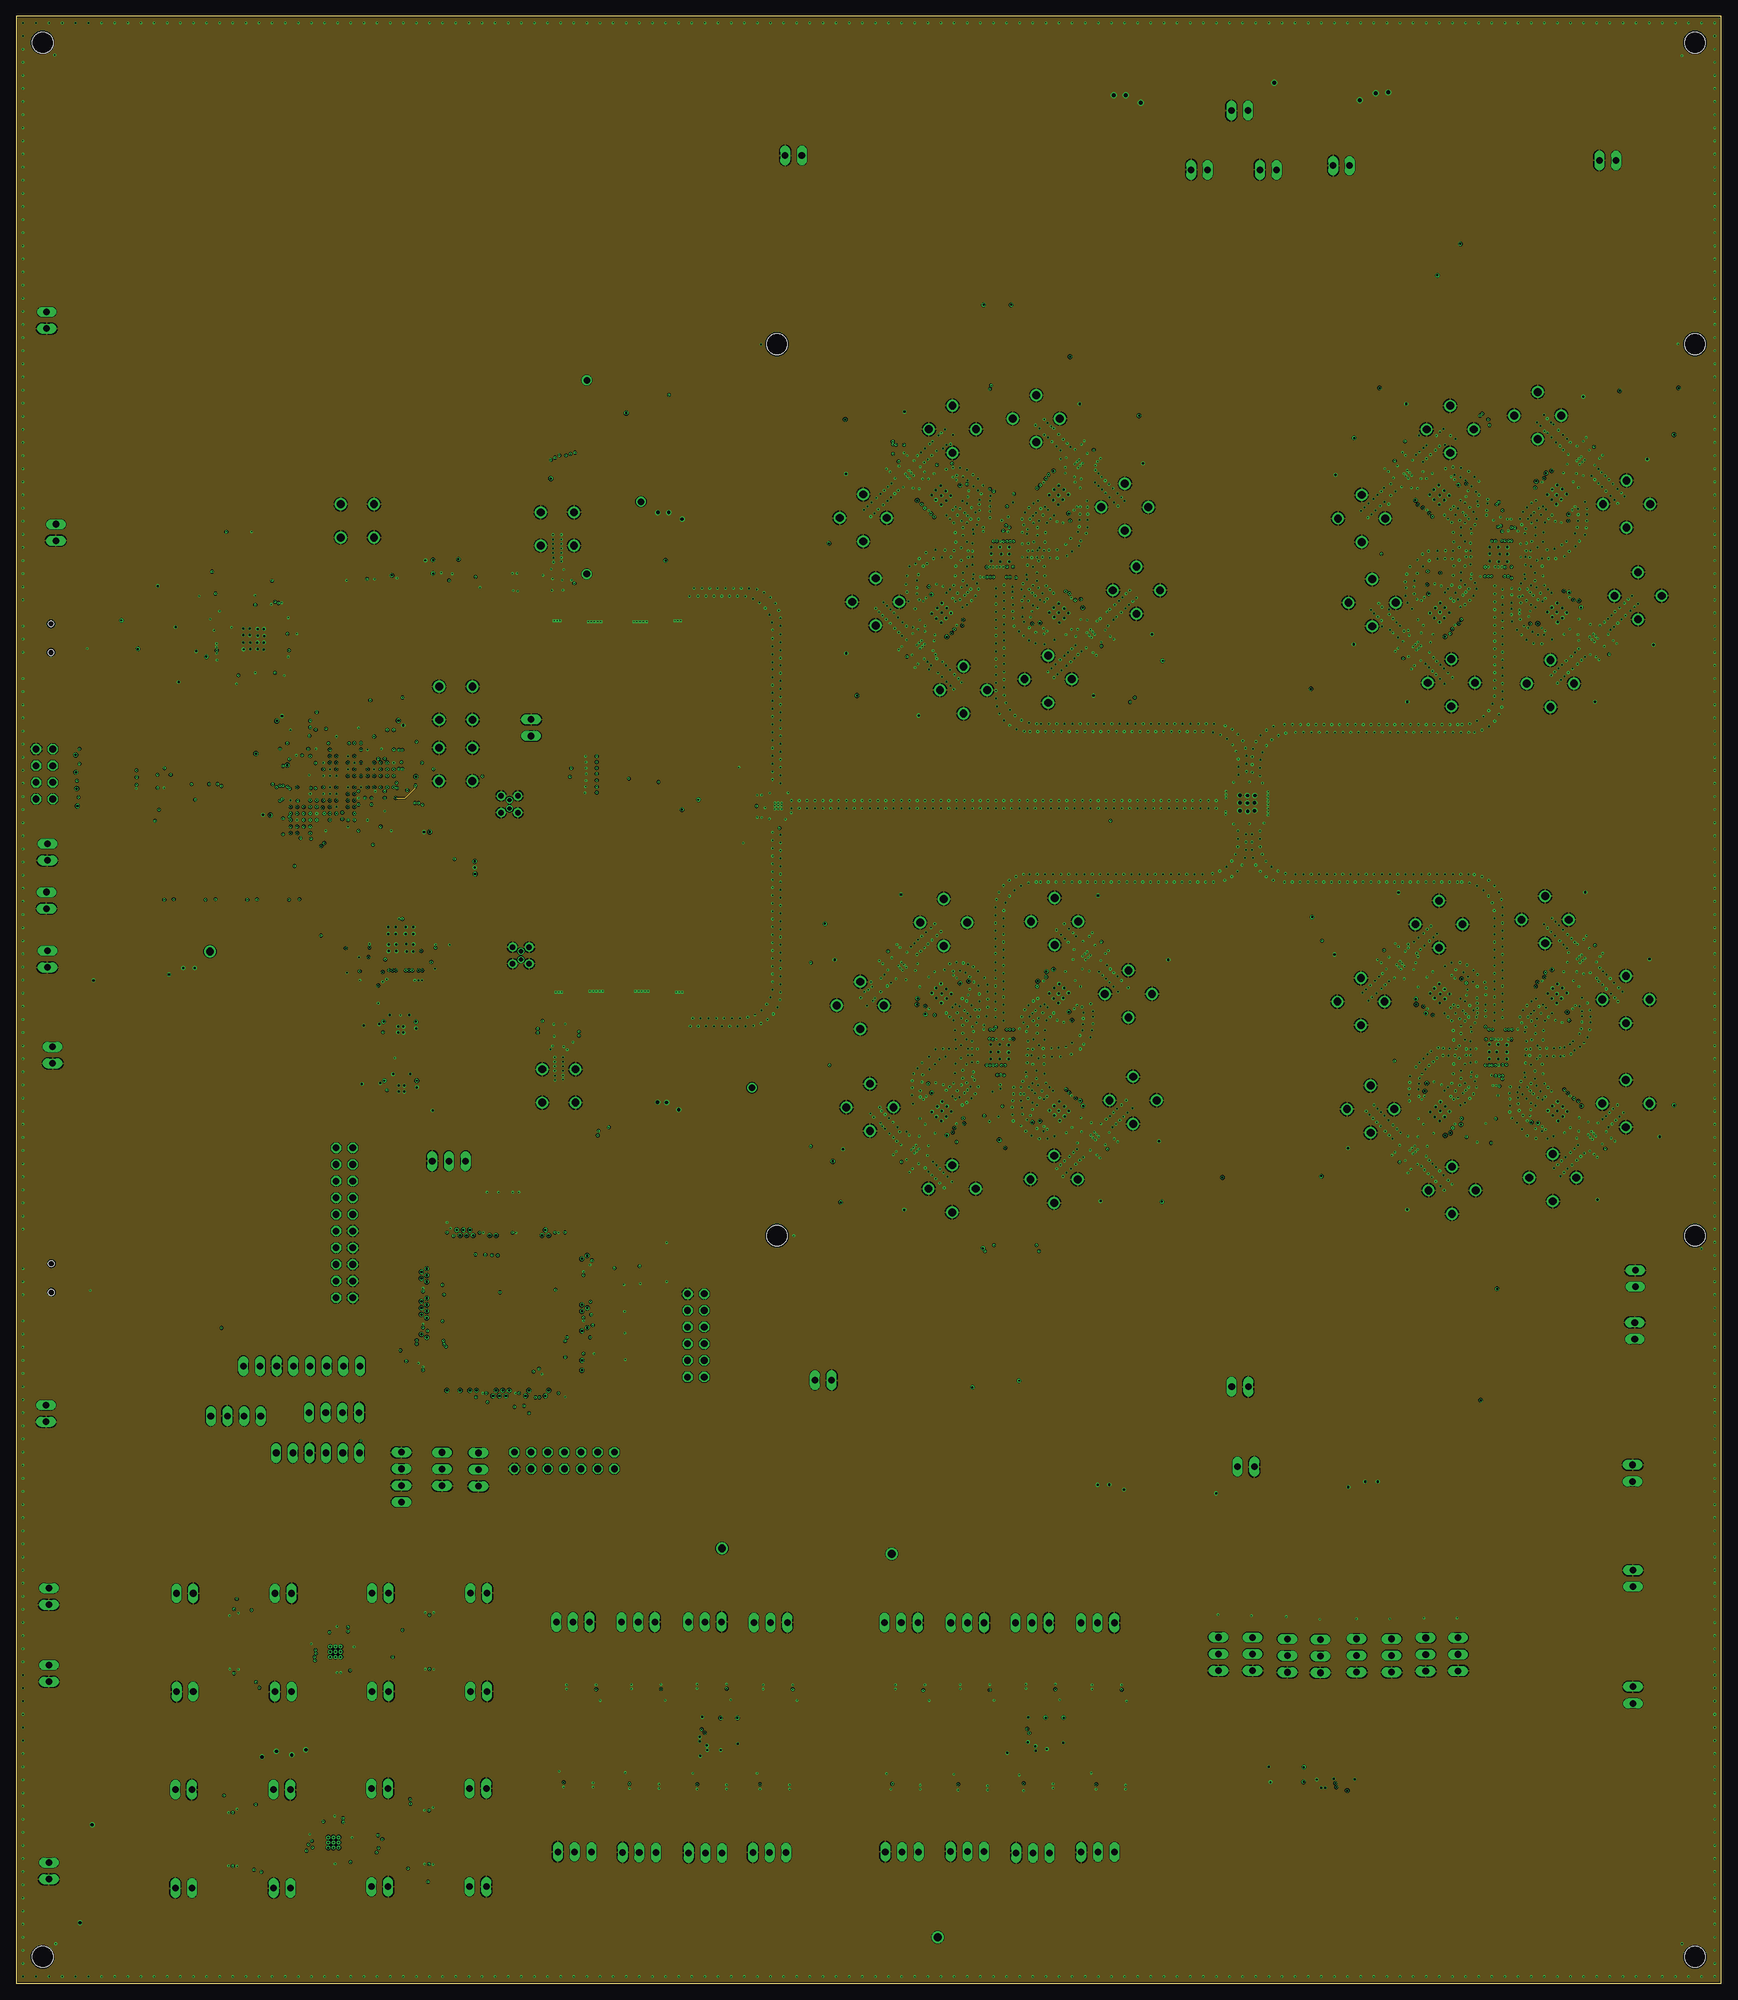
[diagram p28: board, inner layer Route15]
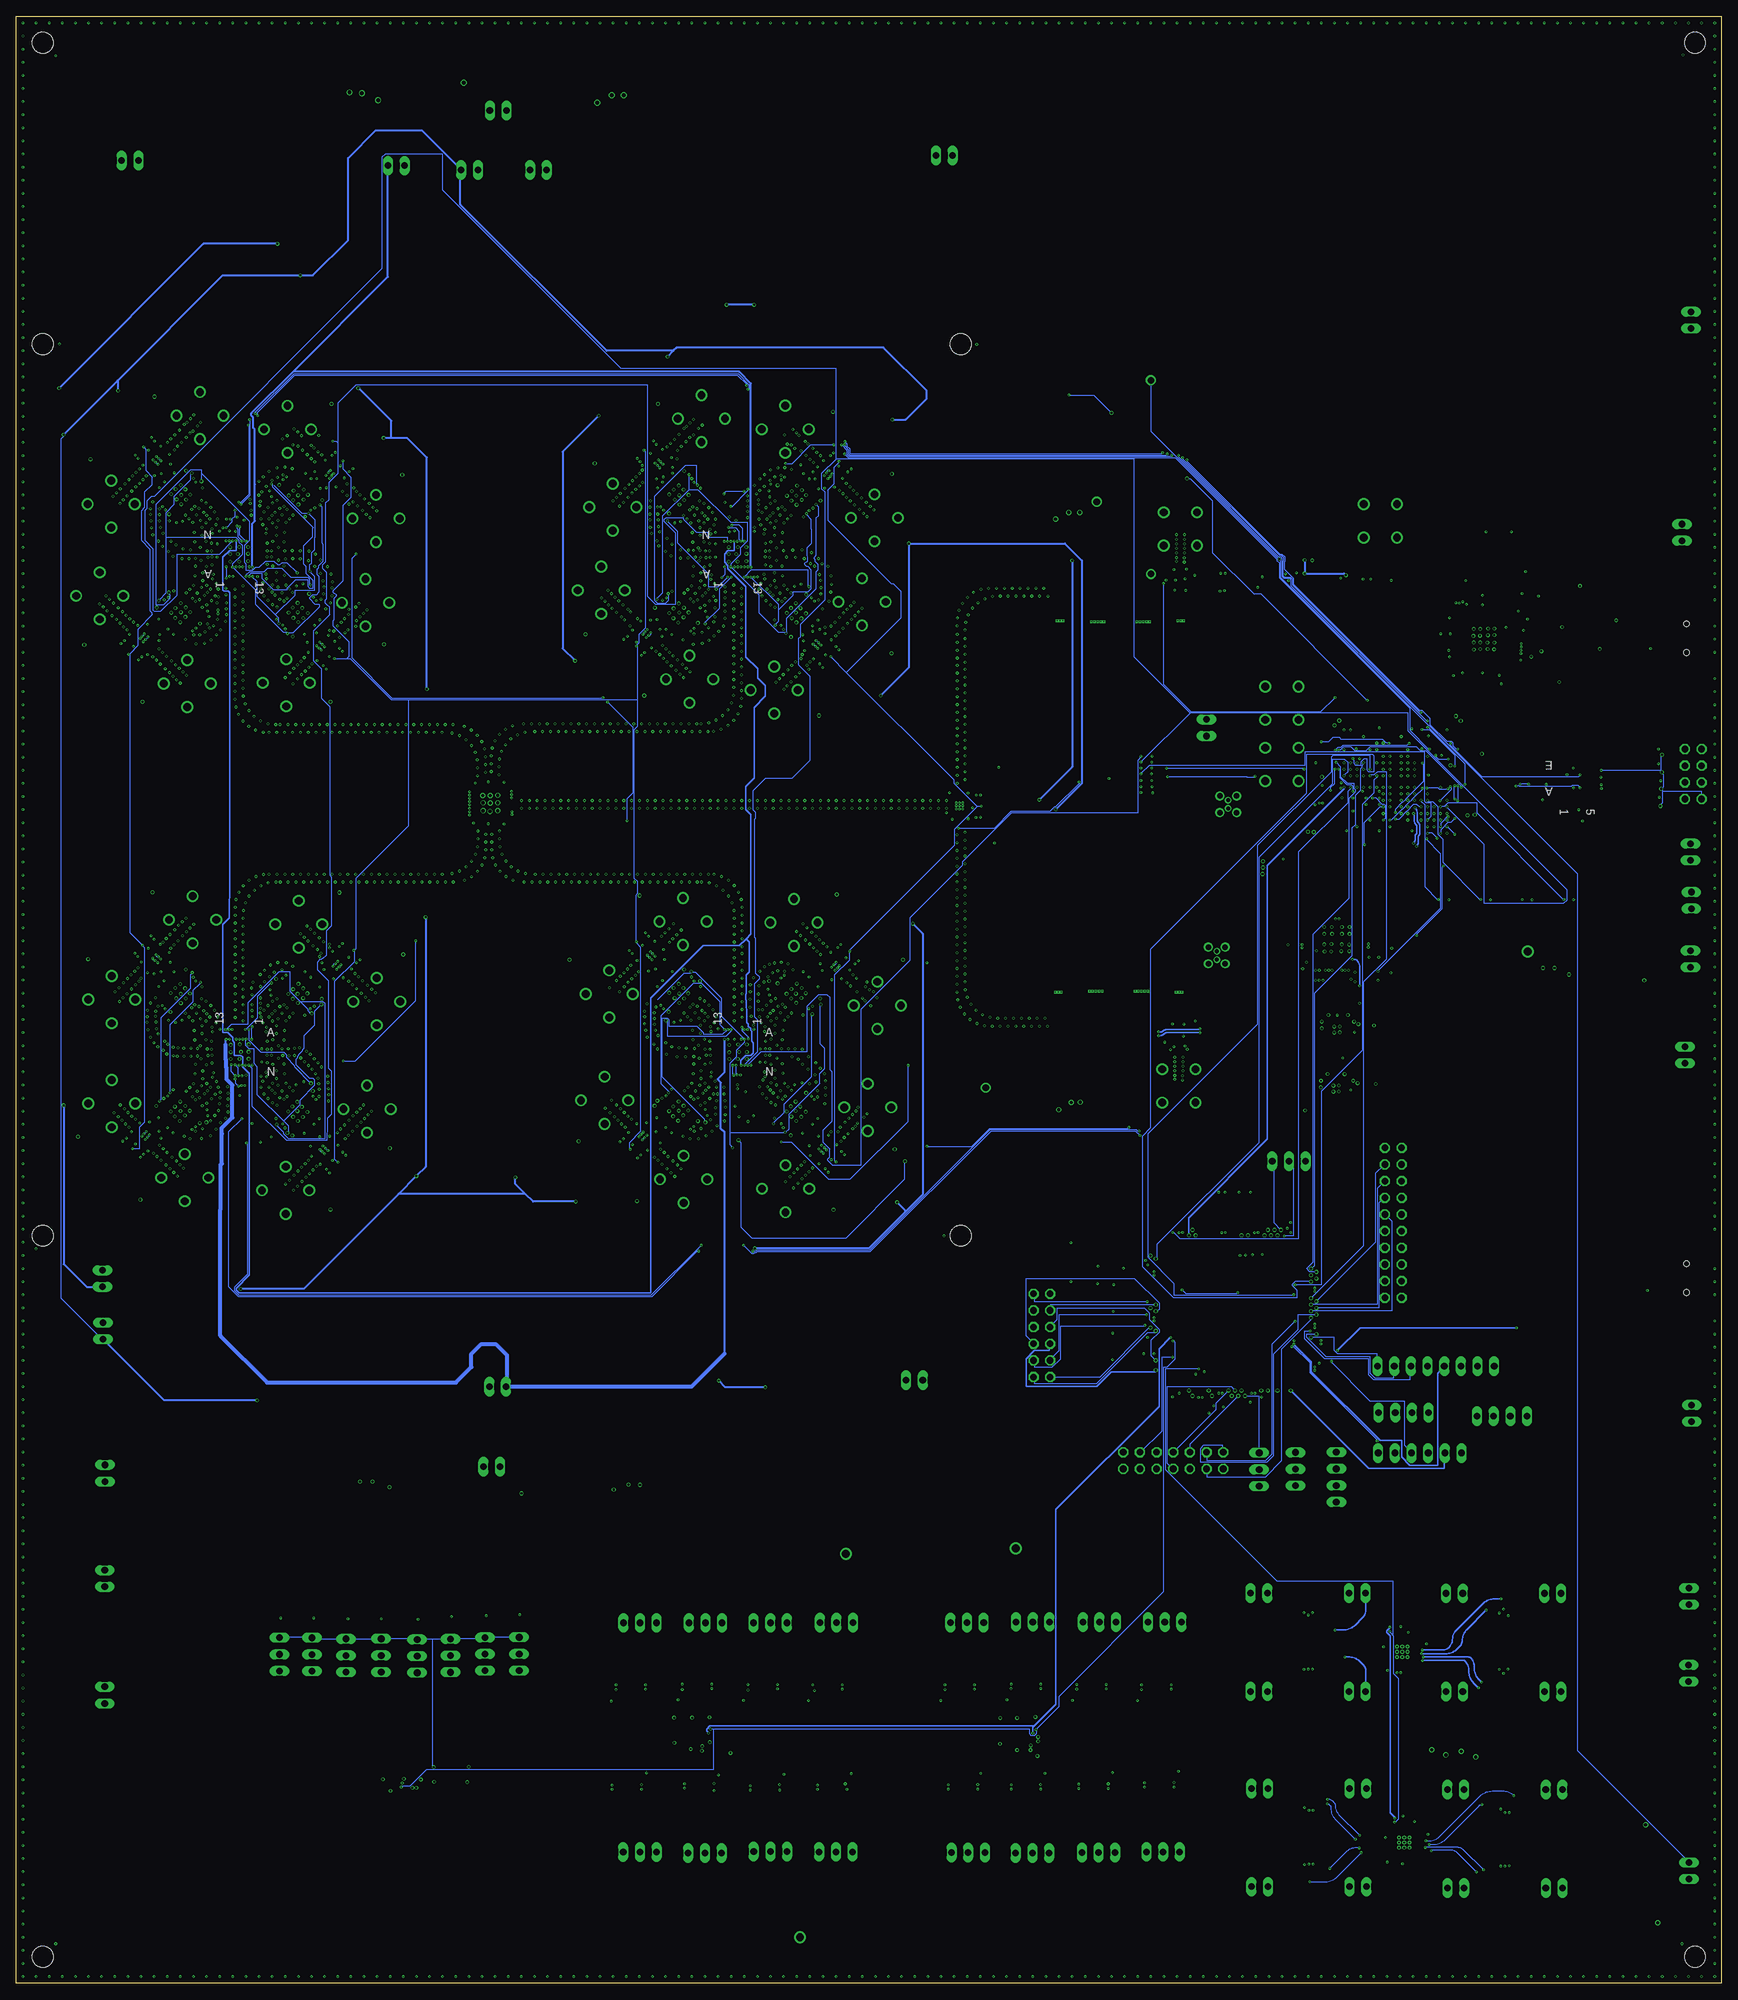
[diagram p29: board, bottom side, seen from below]

Size 260 x 300 mm. Coordinates in mm from the lower left corner, seen from the top.
Outline: 0,0 260,0 260,300 0,300 0,0
Copper layers (1*2+3*4+5*12+13*14+15*16): Top 0.035mm / dielectric 0.102mm / Route2 0.035mm / dielectric 0.2mm / Route3 0.035mm / dielectric 0.2mm / Route4 0.035mm / dielectric 0.2mm / Route5 0.035mm / dielectric 0.2mm / Route12 0.035mm / dielectric 0.15mm / Route13 0.035mm / dielectric 0.2mm / Route14 0.035mm / dielectric 0.2mm / Route15 0.035mm / dielectric 0.102mm / Bottom 0.035mm
Design rules "PCBWay_8L_100um-Track *": minimum track width 0.1mm, minimum drill 0.15mm, track to track 0.1mm, track to pad 0.1mm, pad to pad 0.1mm, via to via 0.1mm, smd to smd 0mil, copper to edge 0.2mm, drill to drill 0.1mm, minimum pad ring 0.15mm, minimum via ring 0.1mm, stop-mask expansion 2mil, vias tented up to drill 0.45mm, thermal gap 0.2mm
Net classes: 1 Differential: width 0.204 mm, drill 0.15 mm; 2 Single_Ended Clocks & RF: width 0.204 mm, drill 0.15 mm
Holes 3.2 mm at 4,4 256,4 256,296 4,296 256,250 256,114 116,114 116,250

## Footprints (pad centres in the part's own frame; a part is rotated, then mirrored left to right if it is on the bottom)
CC-88-1_ADI = smd 4.242 x 3.251: 89 0,0 | smd 0.254 x 0.254: A1 -3,3; A2 -2.5,3; A3 -2,3; A4 -1.5,3; A5 -1,3; A6 -0.5,3; A7 0,3; A8 0.5,3; A9 1,3; A10 1.5,3; A11 2,3; A12 2.5,3; A13 3,3; B1 -3,2.5; B2 -2.5,2.5; B3 -2,2.5; B4 -1.5,2.5; B5 -1,2.5; B6 -0.5,2.5; B7 0,2.5; B8 0.5,2.5; B9 1,2.5; B10 1.5,2.5; B11 2,2.5; B12 2.5,2.5; B13 3,2.5; C1 -3,2; C2 -2.5,2; C12 2.5,2; C13 3,2; D1 -3,1.5; D2 -2.5,1.5; D12 2.5,1.5; D13 3,1.5; E1 -3,1; E2 -2.5,1; E12 2.5,1; E13 3,1; F1 -3,0.5; F2 -2.5,0.5; F12 2.5,0.5; F13 3,0.5; G1 -3,0; G2 -2.5,0; G12 2.5,0; G13 3,0; H1 -3,-0.5; H2 -2.5,-0.5; H12 2.5,-0.5; H13 3,-0.5; J1 -3,-1; J2 -2.5,-1; J12 2.5,-1; J13 3,-1; K1 -3,-1.5; K2 -2.5,-1.5; K12 2.5,-1.5; K13 3,-1.5; L1 -3,-2; L2 -2.5,-2; L12 2.5,-2; L13 3,-2; M1 -3,-2.5; M2 -2.5,-2.5; M3 -2,-2.5; M4 -1.5,-2.5; M5 -1,-2.5; M6 -0.5,-2.5; M7 0,-2.5; M8 0.5,-2.5; M9 1,-2.5; M10 1.5,-2.5; M11 2,-2.5; M12 2.5,-2.5; M13 3,-2.5; N1 -3,-3; N2 -2.5,-3; N3 -2,-3; N4 -1.5,-3; N5 -1,-3; N6 -0.5,-3; N7 0,-3; N8 0.5,-3; N9 1,-3; N10 1.5,-3; N11 2,-3; N12 2.5,-3; N13 3,-3
CC-24-8_ADI = smd 0.508 x 0.356: 1 -2.146,1.625; 2 -2.146,0.975; 3 -2.146,0.325; 4 -2.146,-0.325; 5 -2.146,-0.975; 6 -2.146,-1.625; 13 2.146,-1.625; 14 2.146,-0.975; 15 2.146,-0.325; 16 2.146,0.325; 17 2.146,0.975; 18 2.146,1.625 | smd 0.356 x 0.508: 7 -1.625,-2.146; 8 -0.975,-2.146; 9 -0.325,-2.146; 10 0.325,-2.146; 11 0.975,-2.146; 12 1.625,-2.146; 19 1.625,2.146; 20 0.975,2.146; 21 0.325,2.146; 22 -0.325,2.146; 23 -0.975,2.146; 24 -1.625,2.146 | smd 3.302 x 3.302: 25 0,0
C0201 = smd 0.25 x 0.35: 1 -0.25,0; 2 0.25,0
C0402 = smd 0.7 x 0.9: 1 -0.65,0; 2 0.65,0
C0805 = smd 1.3 x 1.5: 1 -0.95,0; 2 0.95,0
EIA3528 = smd 1.2 x 2.5: A 1.65,0; C -1.65,0
C1206 = smd 1.6 x 1.8: 1 -1.4,0; 2 1.4,0
LED-0603 = smd 1 x 1: A -0.877,0; C 0.877,0
SOIC8 = smd 0.5 x 2.2: 1 -1.905,-3.154; 2 -0.645,-3.154; 3 0.625,-3.154; 4 1.895,-3.154; 5 1.905,3.154; 6 0.635,3.154; 7 -0.635,3.154; 8 -1.905,3.154
1420731211 = smd 0.559 x 0.559: 1 0,0 | drill 1.194 pad 1.791: 2 -2.54,2.54; 3 -2.54,-2.54; 4 2.54,-2.54; 5 2.54,2.54
CJTTPHHSTTH1 = drill 0.64 pad 1: 1 -0.635,0; 2 0.635,0 | drill 0.84 pad 1.365: MH1 -1.27,1.27; MH2 1.27,1.27; MH3 -1.27,-1.27; MH4 1.27,-1.27
2X06 = drill 1.016 octagon: 1 -6.35,-1.27; 2 -6.35,1.27; 3 -3.81,-1.27; 4 -3.81,1.27; 5 -1.27,-1.27; 6 -1.27,1.27; 7 1.27,-1.27; 8 1.27,1.27; 9 3.81,-1.27; 10 3.81,1.27; 11 6.35,-1.27; 12 6.35,1.27
1X06 = drill 1.016 long: 1 -6.35,0; 2 -3.81,0; 3 -1.27,0; 4 1.27,0; 5 3.81,0; 6 6.35,0
2X04 = drill 1.016 octagon: 1 -3.81,-1.27; 2 -3.81,1.27; 3 -1.27,-1.27; 4 -1.27,1.27; 5 1.27,-1.27; 6 1.27,1.27; 7 3.81,-1.27; 8 3.81,1.27
1X03 = drill 1.016 long: 1 -2.54,0; 2 0,0; 3 2.54,0
1X08 = drill 1.016 long: 1 -8.89,0; 2 -6.35,0; 3 -3.81,0; 4 -1.27,0; 5 1.27,0; 6 3.81,0; 7 6.35,0; 8 8.89,0
1X04 = drill 1.016 long: 1 -3.81,0; 2 -1.27,0; 3 1.27,0; 4 3.81,0
2X07 = drill 1.016 octagon: 1 -7.62,-1.27; 2 -7.62,1.27; 3 -5.08,-1.27; 4 -5.08,1.27; 5 -2.54,-1.27; 6 -2.54,1.27; 7 0,-1.27; 8 0,1.27; 9 2.54,-1.27; 10 2.54,1.27; 11 5.08,-1.27; 12 5.08,1.27; 13 7.62,-1.27; 14 7.62,1.27
1X02 = drill 1.016 long: 1 -1.27,0; 2 1.27,0
L5650M = smd 1.8 x 4: 1 -2.5,0; 2 2.5,0
L0201 = smd 0.25 x 0.35: 1 -0.275,0; 2 0.275,0
0402 = smd 0.7 x 0.9: 1 -0.65,0; 2 0.65,0
PW14 = smd 1.676 x 0.356: 1 -2.819,1.95; 2 -2.819,1.3; 3 -2.819,0.65; 4 -2.819,0; 5 -2.819,-0.65; 6 -2.819,-1.3; 7 -2.819,-1.95; 8 2.819,-1.95; 9 2.819,-1.3; 10 2.819,-0.65; 11 2.819,0; 12 2.819,0.65; 13 2.819,1.3; 14 2.819,1.95
R0402 = smd 0.6 x 0.7: 1 -0.5,0; 2 0.5,0
R0201 = smd 0.28 x 0.43: 1 -0.255,0; 2 0.255,0
16_QFN = smd 0.5 x 0.22: 1 -1.4,0.74; 2 -1.4,0.24; 3 -1.4,-0.26; 4 -1.4,-0.76; 9 1.4,-0.76; 10 1.4,-0.26; 11 1.4,0.24; 12 1.4,0.74 | smd 0.22 x 0.5: 5 -0.74,-1.4; 6 -0.24,-1.4; 7 0.26,-1.4; 8 0.76,-1.4; 13 0.76,1.4; 14 0.26,1.4; 15 -0.24,1.4; 16 -0.74,1.4 | smd 1.54 x 1.54: 17 0,0
TACTILE_SWITCH_SMD_4.6X2.8MM = smd 0.9 x 1: 1 -2.05,-0.8; 2 2.05,-0.8; 3 2.05,0.8; 4 -2.05,0.8
SJ_2 = smd 1.168 x 1.6: 1 -1.524,0; 2 0,0; 3 1.524,0
MA10-2 = drill 1.016 octagon: 1 -11.43,-1.27; 2 -11.43,1.27; 3 -8.89,-1.27; 4 -8.89,1.27; 5 -6.35,-1.27; 6 -6.35,1.27; 7 -3.81,-1.27; 8 -3.81,1.27; 9 -1.27,-1.27; 10 -1.27,1.27; 11 1.27,-1.27; 12 1.27,1.27; 13 3.81,-1.27; 14 3.81,1.27; 15 6.35,-1.27; 16 6.35,1.27; 17 8.89,-1.27; 18 8.89,1.27; 19 11.43,-1.27; 20 11.43,1.27
CP_56_5_ADI = smd 0.805 x 0.249: 1 -3.902,3.25; 2 -3.902,2.75; 3 -3.902,2.25; 4 -3.902,1.75; 5 -3.902,1.25; 6 -3.902,0.75; 7 -3.902,0.25; 8 -3.902,-0.25; 9 -3.902,-0.75; 10 -3.902,-1.25; 11 -3.902,-1.75; 12 -3.902,-2.25; 13 -3.902,-2.75; 14 -3.902,-3.25; 29 3.902,-3.25; 30 3.902,-2.75; 31 3.902,-2.25; 32 3.902,-1.75; 33 3.902,-1.25; 34 3.902,-0.75; 35 3.902,-0.25; 36 3.902,0.25; 37 3.902,0.75; 38 3.902,1.25; 39 3.902,1.75; 40 3.902,2.25; 41 3.902,2.75; 42 3.902,3.25 | smd 0.249 x 0.805: 15 -3.25,-3.902; 16 -2.75,-3.902; 17 -2.25,-3.902; 18 -1.75,-3.902; 19 -1.25,-3.902; 20 -0.75,-3.902; 21 -0.25,-3.902; 22 0.25,-3.902; 23 0.75,-3.902; 24 1.25,-3.902; 25 1.75,-3.902; 26 2.25,-3.902; 27 2.75,-3.902; 28 3.25,-3.902; 43 3.25,3.902; 44 2.75,3.902; 45 2.25,3.902; 46 1.75,3.902; 47 1.25,3.902; 48 0.75,3.902; 49 0.25,3.902; 50 -0.25,3.902; 51 -0.75,3.902; 52 -1.25,3.902; 53 -1.75,3.902; 54 -2.25,3.902; 55 -2.75,3.902; 56 -3.25,3.902 | smd 5 x 5: 57 0,0
LQFP-144_STM = smd 1.473 x 0.279: 1 -10.719,8.75; 2 -10.719,8.25; 3 -10.719,7.75; 4 -10.719,7.25; 5 -10.719,6.75; 6 -10.719,6.25; 7 -10.719,5.75; 8 -10.719,5.25; 9 -10.719,4.75; 10 -10.719,4.25; 11 -10.719,3.75; 12 -10.719,3.25; 13 -10.719,2.75; 14 -10.719,2.25; 15 -10.719,1.75; 16 -10.719,1.25; 17 -10.719,0.75; 18 -10.719,0.25; 19 -10.719,-0.25; 20 -10.719,-0.75; 21 -10.719,-1.25; 22 -10.719,-1.75; 23 -10.719,-2.25; 24 -10.719,-2.75; 25 -10.719,-3.25; 26 -10.719,-3.75; 27 -10.719,-4.25; 28 -10.719,-4.75; 29 -10.719,-5.25; 30 -10.719,-5.75; 31 -10.719,-6.25; 32 -10.719,-6.75; 33 -10.719,-7.25; 34 -10.719,-7.75; 35 -10.719,-8.25; 36 -10.719,-8.75; 73 10.719,-8.75; 74 10.719,-8.25; 75 10.719,-7.75; 76 10.719,-7.25; 77 10.719,-6.75; 78 10.719,-6.25; 79 10.719,-5.75; 80 10.719,-5.25; 81 10.719,-4.75; 82 10.719,-4.25; 83 10.719,-3.75; 84 10.719,-3.25; 85 10.719,-2.75; 86 10.719,-2.25; 87 10.719,-1.75; 88 10.719,-1.25; 89 10.719,-0.75; 90 10.719,-0.25; 91 10.719,0.25; 92 10.719,0.75; 93 10.719,1.25; 94 10.719,1.75; 95 10.719,2.25; 96 10.719,2.75; 97 10.719,3.25; 98 10.719,3.75; 99 10.719,4.25; 100 10.719,4.75; 101 10.719,5.25; 102 10.719,5.75; 103 10.719,6.25; 104 10.719,6.75; 105 10.719,7.25; 106 10.719,7.75; 107 10.719,8.25; 108 10.719,8.75 | smd 0.279 x 1.473: 37 -8.75,-10.719; 38 -8.25,-10.719; 39 -7.75,-10.719; 40 -7.25,-10.719; 41 -6.75,-10.719; 42 -6.25,-10.719; 43 -5.75,-10.719; 44 -5.25,-10.719; 45 -4.75,-10.719; 46 -4.25,-10.719; 47 -3.75,-10.719; 48 -3.25,-10.719; 49 -2.75,-10.719; 50 -2.25,-10.719; 51 -1.75,-10.719; 52 -1.25,-10.719; 53 -0.75,-10.719; 54 -0.25,-10.719; 55 0.25,-10.719; 56 0.75,-10.719; 57 1.25,-10.719; 58 1.75,-10.719; 59 2.25,-10.719; 60 2.75,-10.719; 61 3.25,-10.719; 62 3.75,-10.719; 63 4.25,-10.719; 64 4.75,-10.719; 65 5.25,-10.719; 66 5.75,-10.719; 67 6.25,-10.719; 68 6.75,-10.719; 69 7.25,-10.719; 70 7.75,-10.719; 71 8.25,-10.719; 72 8.75,-10.719; 109 8.75,10.719; 110 8.25,10.719; 111 7.75,10.719; 112 7.25,10.719; 113 6.75,10.719; 114 6.25,10.719; 115 5.75,10.719; 116 5.25,10.719; 117 4.75,10.719; 118 4.25,10.719; 119 3.75,10.719; 120 3.25,10.719; 121 2.75,10.719; 122 2.25,10.719; 123 1.75,10.719; 124 1.25,10.719; 125 0.75,10.719; 126 0.25,10.719; 127 -0.25,10.719; 128 -0.75,10.719; 129 -1.25,10.719; 130 -1.75,10.719; 131 -2.25,10.719; 132 -2.75,10.719; 133 -3.25,10.719; 134 -3.75,10.719; 135 -4.25,10.719; 136 -4.75,10.719; 137 -5.25,10.719; 138 -5.75,10.719; 139 -6.25,10.719; 140 -6.75,10.719; 141 -7.25,10.719; 142 -7.75,10.719; 143 -8.25,10.719; 144 -8.75,10.719
RW_28_ADI = smd 1.981 x 0.559: 1 -4.686,8.255; 2 -4.686,6.985; 3 -4.686,5.715; 4 -4.686,4.445; 5 -4.686,3.175; 6 -4.686,1.905; 7 -4.686,0.635; 8 -4.686,-0.635; 9 -4.686,-1.905; 10 -4.686,-3.175; 11 -4.686,-4.445; 12 -4.686,-5.715; 13 -4.686,-6.985; 14 -4.686,-8.255; 15 4.686,-8.255; 16 4.686,-6.985; 17 4.686,-5.715; 18 4.686,-4.445; 19 4.686,-3.175; 20 4.686,-1.905; 21 4.686,-0.635; 22 4.686,0.635; 23 4.686,1.905; 24 4.686,3.175; 25 4.686,4.445; 26 4.686,5.715; 27 4.686,6.985; 28 4.686,8.255
CP_16_3_ADI = smd 0.813 x 0.254: 1 -1.397,0.75; 2 -1.397,0.25; 3 -1.397,-0.25; 4 -1.397,-0.75; 9 1.397,-0.75; 10 1.397,-0.25; 11 1.397,0.25; 12 1.397,0.75 | smd 0.254 x 0.813: 5 -0.75,-1.397; 6 -0.25,-1.397; 7 0.25,-1.397; 8 0.75,-1.397; 13 0.75,1.397; 14 0.25,1.397; 15 -0.25,1.397; 16 -0.75,1.397 | smd 1.651 x 1.651: 17 0,0
UDB_12_ADI = smd 0.813 x 0.254: 1 -1.448,0.5; 2 -1.448,0; 3 -1.448,-0.5; 7 1.448,-0.5; 8 1.448,0; 9 1.448,0.5 | smd 0.254 x 0.813: 4 -0.5,-0.953; 5 0,-0.953; 6 0.5,-0.953; 10 0.5,0.953; 11 0,0.953; 12 -0.5,0.953
64QFN_FT2232HQ_FTD = smd 0.755 x 0.254: 1 -4.461,3.75; 2 -4.461,3.25; 3 -4.461,2.75; 4 -4.461,2.25; 5 -4.461,1.75; 6 -4.461,1.25; 7 -4.461,0.75; 8 -4.461,0.25; 9 -4.461,-0.25; 10 -4.461,-0.75; 11 -4.461,-1.25; 12 -4.461,-1.75; 13 -4.461,-2.25; 14 -4.461,-2.75; 15 -4.461,-3.25; 16 -4.461,-3.75; 33 4.461,-3.75; 34 4.461,-3.25; 35 4.461,-2.75; 36 4.461,-2.25; 37 4.461,-1.75; 38 4.461,-1.25; 39 4.461,-0.75; 40 4.461,-0.25; 41 4.461,0.25; 42 4.461,0.75; 43 4.461,1.25; 44 4.461,1.75; 45 4.461,2.25; 46 4.461,2.75; 47 4.461,3.25; 48 4.461,3.75 | smd 0.254 x 0.755: 17 -3.75,-4.461; 18 -3.25,-4.461; 19 -2.75,-4.461; 20 -2.25,-4.461; 21 -1.75,-4.461; 22 -1.25,-4.461; 23 -0.75,-4.461; 24 -0.25,-4.461; 25 0.25,-4.461; 26 0.75,-4.461; 27 1.25,-4.461; 28 1.75,-4.461; 29 2.25,-4.461; 30 2.75,-4.461; 31 3.25,-4.461; 32 3.75,-4.461; 49 3.75,4.461; 50 3.25,4.461; 51 2.75,4.461; 52 2.25,4.461; 53 1.75,4.461; 54 1.25,4.461; 55 0.75,4.461; 56 0.25,4.461; 57 -0.25,4.461; 58 -0.75,4.461; 59 -1.25,4.461; 60 -1.75,4.461; 61 -2.25,4.461; 62 -2.75,4.461; 63 -3.25,4.461; 64 -3.75,4.461 | smd 4.445 x 4.445: 65 0,0
RGE24_2P7X2P7 = smd 0.85 x 0.28: 1 -1.975,1.25; 2 -1.975,0.75; 3 -1.975,0.25; 4 -1.975,-0.25; 5 -1.975,-0.75; 6 -1.975,-1.25; 13 1.975,-1.25; 14 1.975,-0.75; 15 1.975,-0.25; 16 1.975,0.25; 17 1.975,0.75; 18 1.975,1.25 | smd 0.28 x 0.85: 7 -1.25,-1.975; 8 -0.75,-1.975; 9 -0.25,-1.975; 10 0.25,-1.975; 11 0.75,-1.975; 12 1.25,-1.975; 19 1.25,1.975; 20 0.75,1.975; 21 0.25,1.975; 22 -0.25,1.975; 23 -0.75,1.975; 24 -1.25,1.975 | smd 2.7 x 2.7: 25 0,0 | drill 0.254 pad 0.508: V -0.787,-0.787; V_1 -0.787,0; V_2 -0.787,0.787; V_3 0,-0.787; V_4 0,0; V_5 0,0.787; V_6 0.787,-0.787; V_7 0.787,0; V_8 0.787,0.787
BGA24_MT25QL_MRN = smd 0.33 x 0.33: A2 -1,2; A3 0,2; A4 1,2; A5 2,2; B1 -2,1; B2 -1,1; B3 0,1; B4 1,1; B5 2,1; C1 -2,0; C2 -1,0; C3 0,0; C4 1,0; C5 2,0; D1 -2,-1; D2 -1,-1; D3 0,-1; D4 1,-1; D5 2,-1; E1 -2,-2; E2 -1,-2; E3 0,-2; E4 1,-2; E5 2,-2
PW16 = smd 1.676 x 0.356: 1 -2.819,2.275; 2 -2.819,1.625; 3 -2.819,0.975; 4 -2.819,0.325; 5 -2.819,-0.325; 6 -2.819,-0.975; 7 -2.819,-1.625; 8 -2.819,-2.275; 9 2.819,-2.275; 10 2.819,-1.625; 11 2.819,-0.975; 12 2.819,-0.325; 13 2.819,0.325; 14 2.819,0.975; 15 2.819,1.625; 16 2.819,2.275
DGK0008A-MFG = smd 1.4 x 0.45: 1 -2.2,0.975; 2 -2.2,0.325; 3 -2.2,-0.325; 4 -2.2,-0.975; 5 2.2,-0.975; 6 2.2,-0.325; 7 2.2,0.325; 8 2.2,0.975
SOD-123_ONS = smd 1.219 x 0.762: 1 -1.676,0; 2 1.676,0
DG1677-2_MNC = smd 0.711 x 0.178: 1 -2.451,1.778; 2 -2.451,1.27; 3 -2.451,0.762; 4 -2.451,0.254; 5 -2.451,-0.254; 6 -2.451,-0.762; 7 -2.451,-1.27; 8 -2.451,-1.778; 17 2.451,-1.778; 18 2.451,-1.27; 19 2.451,-0.762; 20 2.451,-0.254; 21 2.451,0.254; 22 2.451,0.762; 23 2.451,1.27; 24 2.451,1.778 | smd 0.178 x 0.711: 9 -1.778,-2.451; 10 -1.27,-2.451; 11 -0.762,-2.451; 12 -0.254,-2.451; 13 0.254,-2.451; 14 0.762,-2.451; 15 1.27,-2.451; 16 1.778,-2.451; 25 1.778,2.451; 26 1.27,2.451; 27 0.762,2.451; 28 0.254,2.451; 29 -0.254,2.451; 30 -0.762,2.451; 31 -1.27,2.451; 32 -1.778,2.451 | smd 3.607 x 3.607: 33 0,0
BGA256C100P16X16_1700X1700X155 = smd 0.45 x 0.45: A1 -7.5,7.5; A2 -6.5,7.5; A3 -5.5,7.5; A4 -4.5,7.5; A5 -3.5,7.5; A6 -2.5,7.5; A7 -1.5,7.5; A8 -0.5,7.5; A9 0.5,7.5; A10 1.5,7.5; A11 2.5,7.5; A12 3.5,7.5; A13 4.5,7.5; A14 5.5,7.5; A15 6.5,7.5; A16 7.5,7.5; B1 -7.5,6.5; B2 -6.5,6.5; B3 -5.5,6.5; B4 -4.5,6.5; B5 -3.5,6.5; B6 -2.5,6.5; B7 -1.5,6.5; B8 -0.5,6.5; B9 0.5,6.5; B10 1.5,6.5; B11 2.5,6.5; B12 3.5,6.5; B13 4.5,6.5; B14 5.5,6.5; B15 6.5,6.5; B16 7.5,6.5; C1 -7.5,5.5; C2 -6.5,5.5; C3 -5.5,5.5; C4 -4.5,5.5; C5 -3.5,5.5; C6 -2.5,5.5; C7 -1.5,5.5; C8 -0.5,5.5; C9 0.5,5.5; C10 1.5,5.5; C11 2.5,5.5; C12 3.5,5.5; C13 4.5,5.5; C14 5.5,5.5; C15 6.5,5.5; C16 7.5,5.5; D1 -7.5,4.5; D2 -6.5,4.5; D3 -5.5,4.5; D4 -4.5,4.5; D5 -3.5,4.5; D6 -2.5,4.5; D7 -1.5,4.5; D8 -0.5,4.5; D9 0.5,4.5; D10 1.5,4.5; D11 2.5,4.5; D12 3.5,4.5; D13 4.5,4.5; D14 5.5,4.5; D15 6.5,4.5; D16 7.5,4.5; E1 -7.5,3.5; E2 -6.5,3.5; E3 -5.5,3.5; E4 -4.5,3.5; E5 -3.5,3.5; E6 -2.5,3.5; E7 -1.5,3.5; E8 -0.5,3.5; E9 0.5,3.5; E10 1.5,3.5; E11 2.5,3.5; E12 3.5,3.5; E13 4.5,3.5; E14 5.5,3.5; E15 6.5,3.5; E16 7.5,3.5; F1 -7.5,2.5; F2 -6.5,2.5; F3 -5.5,2.5; F4 -4.5,2.5; F5 -3.5,2.5; F6 -2.5,2.5; F7 -1.5,2.5; F8 -0.5,2.5; F9 0.5,2.5; F10 1.5,2.5; F11 2.5,2.5; F12 3.5,2.5; F13 4.5,2.5; F14 5.5,2.5; F15 6.5,2.5; F16 7.5,2.5; G1 -7.5,1.5; G2 -6.5,1.5; G3 -5.5,1.5; G4 -4.5,1.5; G5 -3.5,1.5; G6 -2.5,1.5; G7 -1.5,1.5; G8 -0.5,1.5; G9 0.5,1.5; G10 1.5,1.5; G11 2.5,1.5; G12 3.5,1.5; G13 4.5,1.5; G14 5.5,1.5; G15 6.5,1.5; G16 7.5,1.5; H1 -7.5,0.5; H2 -6.5,0.5; H3 -5.5,0.5; H4 -4.5,0.5; H5 -3.5,0.5; H6 -2.5,0.5; H7 -1.5,0.5; H8 -0.5,0.5; H9 0.5,0.5; H10 1.5,0.5; H11 2.5,0.5; H12 3.5,0.5; H13 4.5,0.5; H14 5.5,0.5; H15 6.5,0.5; H16 7.5,0.5; J1 -7.5,-0.5; J2 -6.5,-0.5; J3 -5.5,-0.5; J4 -4.5,-0.5; J5 -3.5,-0.5; J6 -2.5,-0.5; J7 -1.5,-0.5; J8 -0.5,-0.5; J9 0.5,-0.5; J10 1.5,-0.5; J11 2.5,-0.5; J12 3.5,-0.5; J13 4.5,-0.5; J14 5.5,-0.5; J15 6.5,-0.5; J16 7.5,-0.5; K1 -7.5,-1.5; K2 -6.5,-1.5; K3 -5.5,-1.5; K4 -4.5,-1.5; K5 -3.5,-1.5; K6 -2.5,-1.5; K7 -1.5,-1.5; K8 -0.5,-1.5; K9 0.5,-1.5; K10 1.5,-1.5; K11 2.5,-1.5; K12 3.5,-1.5; K13 4.5,-1.5; K14 5.5,-1.5; K15 6.5,-1.5; K16 7.5,-1.5; L1 -7.5,-2.5; L2 -6.5,-2.5; L3 -5.5,-2.5; L4 -4.5,-2.5; L5 -3.5,-2.5; L6 -2.5,-2.5; L7 -1.5,-2.5; L8 -0.5,-2.5; L9 0.5,-2.5; L10 1.5,-2.5; L11 2.5,-2.5; L12 3.5,-2.5; L13 4.5,-2.5; L14 5.5,-2.5; L15 6.5,-2.5; L16 7.5,-2.5; M1 -7.5,-3.5; M2 -6.5,-3.5; M3 -5.5,-3.5; M4 -4.5,-3.5; M5 -3.5,-3.5; M6 -2.5,-3.5; M7 -1.5,-3.5; M8 -0.5,-3.5; M9 0.5,-3.5; M10 1.5,-3.5; M11 2.5,-3.5; M12 3.5,-3.5; M13 4.5,-3.5; M14 5.5,-3.5; M15 6.5,-3.5; M16 7.5,-3.5; N1 -7.5,-4.5; N2 -6.5,-4.5; N3 -5.5,-4.5; N4 -4.5,-4.5; N5 -3.5,-4.5; N6 -2.5,-4.5; N7 -1.5,-4.5; N8 -0.5,-4.5; N9 0.5,-4.5; N10 1.5,-4.5; N11 2.5,-4.5; N12 3.5,-4.5; N13 4.5,-4.5; N14 5.5,-4.5; N15 6.5,-4.5; N16 7.5,-4.5; P1 -7.5,-5.5; P2 -6.5,-5.5; P3 -5.5,-5.5; P4 -4.5,-5.5; P5 -3.5,-5.5; P6 -2.5,-5.5; P7 -1.5,-5.5; P8 -0.5,-5.5; P9 0.5,-5.5; P10 1.5,-5.5; P11 2.5,-5.5; P12 3.5,-5.5; P13 4.5,-5.5; P14 5.5,-5.5; P15 6.5,-5.5; P16 7.5,-5.5; R1 -7.5,-6.5; R2 -6.5,-6.5; R3 -5.5,-6.5; R4 -4.5,-6.5; R5 -3.5,-6.5; R6 -2.5,-6.5; R7 -1.5,-6.5; R8 -0.5,-6.5; R9 0.5,-6.5; R10 1.5,-6.5; R11 2.5,-6.5; R12 3.5,-6.5; R13 4.5,-6.5; R14 5.5,-6.5; R15 6.5,-6.5; R16 7.5,-6.5; T1 -7.5,-7.5; T2 -6.5,-7.5; T3 -5.5,-7.5; T4 -4.5,-7.5; T5 -3.5,-7.5; T6 -2.5,-7.5; T7 -1.5,-7.5; T8 -0.5,-7.5; T9 0.5,-7.5; T10 1.5,-7.5; T11 2.5,-7.5; T12 3.5,-7.5; T13 4.5,-7.5; T14 5.5,-7.5; T15 6.5,-7.5; T16 7.5,-7.5
BPF2 = smd 0.169 x 0.169: P$1 0,0.1; P$2 18.415,0.1
22-23-2021 = drill 1 long: 1 -1.27,0; 2 1.27,0
32005-201 = smd 3.1 x 0.5: 1 3,1.6; 2 3,0.8; 3 3,0; 4 3,-0.8; 5 3,-1.6 | smd 2.5 x 2: M1 -3,-4.45; M2 -3,4.45 | smd 3.3 x 2: M3 2.9,4.45; M4 2.9,-4.45 | hole 0.9: 0,2.2; 0,-2.2
22-23-2031 = drill 1 long: 1 -2.54,0; 2 0,0; 3 2.54,0
XTAL_NX3225GD-8MHZ-STD-CRA-3_N = smd 1.295 x 2.388: 1 -0.953,0; 2 0.953,0
CRYSTAL-SMD-2X2.5MM = smd 1.2 x 1.1: P1 0.846,0.69; P2 -0.854,0.69; P3 -0.854,-0.71; P4 0.846,-0.71